# Altium project OCP-TimeCardMini-TI.PrjPcb (part 3 of 6)

## Sheet 11-DPLL-2.SchDoc
size B; SheetNumber: 11; SheetTotal: 25; SPICEModelCacheYEUHMWUF: <root> / <DocumentId>YEUHMWUF</DocumentId> / </root>
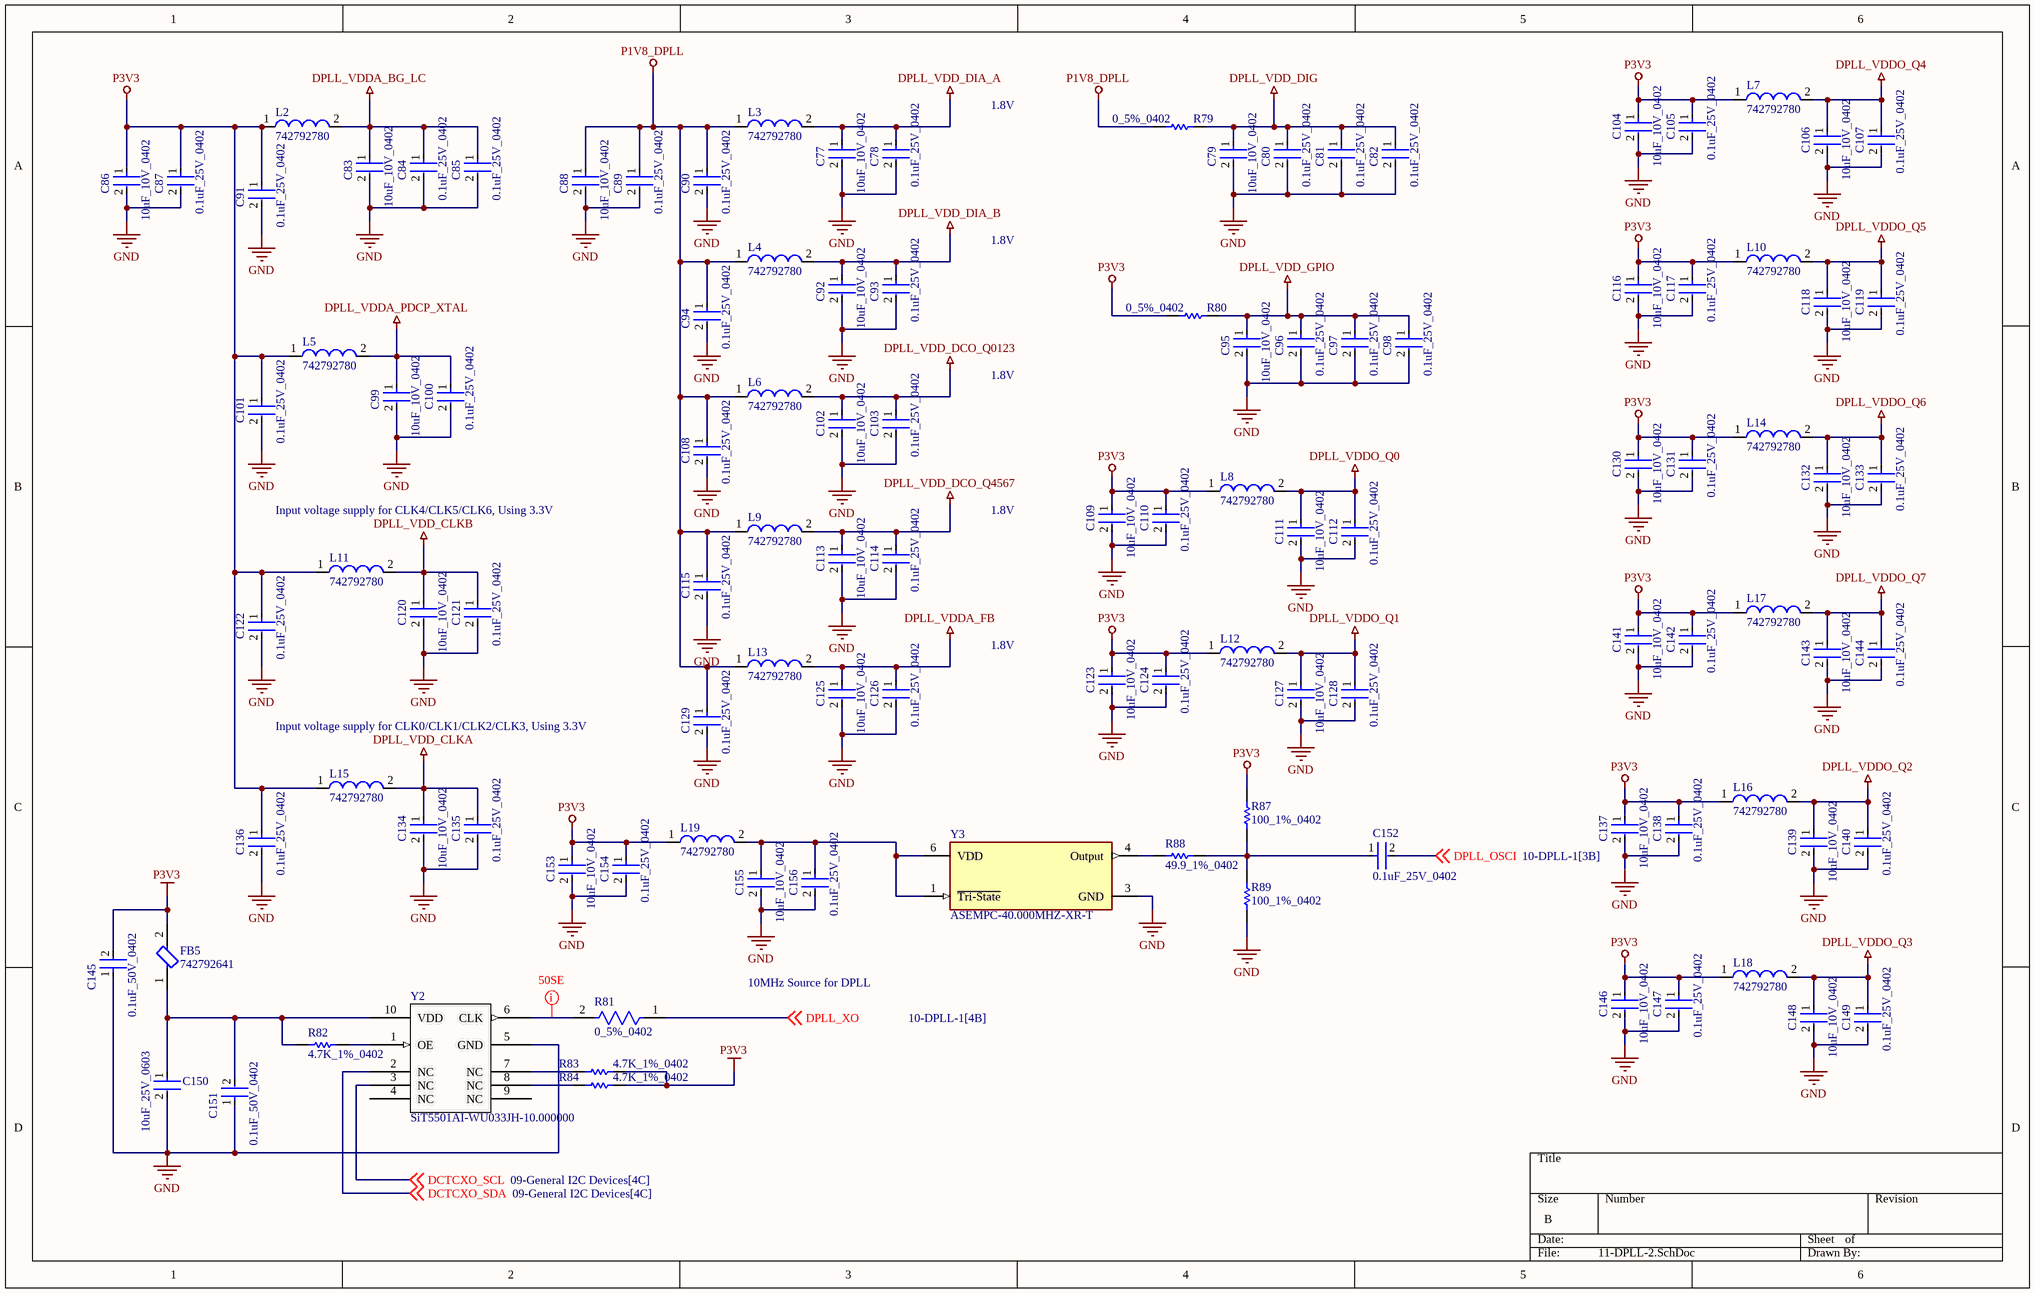
[diagram p10: 11-DPLL-2.SchDoc]

### Parts
C77  10uF_10V_0402  [FP-CL05A106MP5NUNC-MFG]
C78  0.1uF_25V_0402  [FP-0402-L_1_0_1-W_0_5_0_1-IPC_C]
C79  10uF_10V_0402  [FP-CL05A106MP5NUNC-MFG]
C80  0.1uF_25V_0402  [FP-0402-L_1_0_1-W_0_5_0_1-IPC_C]
C81  0.1uF_25V_0402  [FP-0402-L_1_0_1-W_0_5_0_1-IPC_C]
C82  0.1uF_25V_0402  [FP-0402-L_1_0_1-W_0_5_0_1-IPC_C]
C83  10uF_10V_0402  [FP-CL05A106MP5NUNC-MFG]
C84  0.1uF_25V_0402  [FP-0402-L_1_0_1-W_0_5_0_1-IPC_C]
C85  0.1uF_25V_0402  [FP-0402-L_1_0_1-W_0_5_0_1-IPC_C]
C86  10uF_10V_0402  [FP-CL05A106MP5NUNC-MFG]
C87  0.1uF_25V_0402  [FP-0402-L_1_0_1-W_0_5_0_1-IPC_C]
C88  10uF_10V_0402  [FP-CL05A106MP5NUNC-MFG]
C89  0.1uF_25V_0402  [FP-0402-L_1_0_1-W_0_5_0_1-IPC_C]
C90  0.1uF_25V_0402  [FP-0402-L_1_0_1-W_0_5_0_1-IPC_C]
C91  0.1uF_25V_0402  [FP-0402-L_1_0_1-W_0_5_0_1-IPC_C]
C92  10uF_10V_0402  [FP-CL05A106MP5NUNC-MFG]
C93  0.1uF_25V_0402  [FP-0402-L_1_0_1-W_0_5_0_1-IPC_C]
C94  0.1uF_25V_0402  [FP-0402-L_1_0_1-W_0_5_0_1-IPC_C]
C95  10uF_10V_0402  [FP-CL05A106MP5NUNC-MFG]
C96  0.1uF_25V_0402  [FP-0402-L_1_0_1-W_0_5_0_1-IPC_C]
C97  0.1uF_25V_0402  [FP-0402-L_1_0_1-W_0_5_0_1-IPC_C]
C98  0.1uF_25V_0402  [FP-0402-L_1_0_1-W_0_5_0_1-IPC_C]
C99  10uF_10V_0402  [FP-CL05A106MP5NUNC-MFG]
C100  0.1uF_25V_0402  [FP-0402-L_1_0_1-W_0_5_0_1-IPC_C]
C101  0.1uF_25V_0402  [FP-0402-L_1_0_1-W_0_5_0_1-IPC_C]
C102  10uF_10V_0402  [FP-CL05A106MP5NUNC-MFG]
C103  0.1uF_25V_0402  [FP-0402-L_1_0_1-W_0_5_0_1-IPC_C]
C104  10uF_10V_0402  [FP-CL05A106MP5NUNC-MFG]
C105  0.1uF_25V_0402  [FP-0402-L_1_0_1-W_0_5_0_1-IPC_C]
C106  10uF_10V_0402  [FP-CL05A106MP5NUNC-MFG]
C107  0.1uF_25V_0402  [FP-0402-L_1_0_1-W_0_5_0_1-IPC_C]
C108  0.1uF_25V_0402  [FP-0402-L_1_0_1-W_0_5_0_1-IPC_C]
C109  10uF_10V_0402  [FP-CL05A106MP5NUNC-MFG]
C110  0.1uF_25V_0402  [FP-0402-L_1_0_1-W_0_5_0_1-IPC_C]
C111  10uF_10V_0402  [FP-CL05A106MP5NUNC-MFG]
C112  0.1uF_25V_0402  [FP-0402-L_1_0_1-W_0_5_0_1-IPC_C]
C113  10uF_10V_0402  [FP-CL05A106MP5NUNC-MFG]
C114  0.1uF_25V_0402  [FP-0402-L_1_0_1-W_0_5_0_1-IPC_C]
C115  0.1uF_25V_0402  [FP-0402-L_1_0_1-W_0_5_0_1-IPC_C]
C116  10uF_10V_0402  [FP-CL05A106MP5NUNC-MFG]
C117  0.1uF_25V_0402  [FP-0402-L_1_0_1-W_0_5_0_1-IPC_C]
C118  10uF_10V_0402  [FP-CL05A106MP5NUNC-MFG]
C119  0.1uF_25V_0402  [FP-0402-L_1_0_1-W_0_5_0_1-IPC_C]
C120  10uF_10V_0402  [FP-CL05A106MP5NUNC-MFG]
C121  0.1uF_25V_0402  [FP-0402-L_1_0_1-W_0_5_0_1-IPC_C]
C122  0.1uF_25V_0402  [FP-0402-L_1_0_1-W_0_5_0_1-IPC_C]
C123  10uF_10V_0402  [FP-CL05A106MP5NUNC-MFG]
C124  0.1uF_25V_0402  [FP-0402-L_1_0_1-W_0_5_0_1-IPC_C]
C125  10uF_10V_0402  [FP-CL05A106MP5NUNC-MFG]
C126  0.1uF_25V_0402  [FP-0402-L_1_0_1-W_0_5_0_1-IPC_C]
C127  10uF_10V_0402  [FP-CL05A106MP5NUNC-MFG]
C128  0.1uF_25V_0402  [FP-0402-L_1_0_1-W_0_5_0_1-IPC_C]
C129  0.1uF_25V_0402  [FP-0402-L_1_0_1-W_0_5_0_1-IPC_C]
C130  10uF_10V_0402  [FP-CL05A106MP5NUNC-MFG]
C131  0.1uF_25V_0402  [FP-0402-L_1_0_1-W_0_5_0_1-IPC_C]
C132  10uF_10V_0402  [FP-CL05A106MP5NUNC-MFG]
C133  0.1uF_25V_0402  [FP-0402-L_1_0_1-W_0_5_0_1-IPC_C]
C134  10uF_10V_0402  [FP-CL05A106MP5NUNC-MFG]
C135  0.1uF_25V_0402  [FP-0402-L_1_0_1-W_0_5_0_1-IPC_C]
C136  0.1uF_25V_0402  [FP-0402-L_1_0_1-W_0_5_0_1-IPC_C]
C137  10uF_10V_0402  [FP-CL05A106MP5NUNC-MFG]
C138  0.1uF_25V_0402  [FP-0402-L_1_0_1-W_0_5_0_1-IPC_C]
C139  10uF_10V_0402  [FP-CL05A106MP5NUNC-MFG]
C140  0.1uF_25V_0402  [FP-0402-L_1_0_1-W_0_5_0_1-IPC_C]
C141  10uF_10V_0402  [FP-CL05A106MP5NUNC-MFG]
C142  0.1uF_25V_0402  [FP-0402-L_1_0_1-W_0_5_0_1-IPC_C]
C143  10uF_10V_0402  [FP-CL05A106MP5NUNC-MFG]
C144  0.1uF_25V_0402  [FP-0402-L_1_0_1-W_0_5_0_1-IPC_C]
C145  0.1uF_50V_0402  [FP-C1005-050-0_05-IPC_C]
C146  10uF_10V_0402  [FP-CL05A106MP5NUNC-MFG]
C147  0.1uF_25V_0402  [FP-0402-L_1_0_1-W_0_5_0_1-IPC_C]
C148  10uF_10V_0402  [FP-CL05A106MP5NUNC-MFG]
C149  0.1uF_25V_0402  [FP-0402-L_1_0_1-W_0_5_0_1-IPC_C]
C150  10uF_25V_0603  [FP-CL10-IPC_C]
C151  0.1uF_50V_0402  [FP-C1005-050-0_05-IPC_C]
C152  0.1uF_25V_0402  [FP-0402-L_1_0_1-W_0_5_0_1-IPC_C]
C153  10uF_10V_0402  [FP-CL05A106MP5NUNC-MFG]
C154  0.1uF_25V_0402  [FP-0402-L_1_0_1-W_0_5_0_1-IPC_C]
C155  10uF_10V_0402  [FP-CL05A106MP5NUNC-MFG]
C156  0.1uF_25V_0402  [FP-0402-L_1_0_1-W_0_5_0_1-IPC_C]
FB5  742792641  [FP-742792641-MFG]
L2  742792780  [SMD-0402]
L3  742792780  [SMD-0402]
L4  742792780  [SMD-0402]
L5  742792780  [SMD-0402]
L6  742792780  [SMD-0402]
L7  742792780  [SMD-0402]
L8  742792780  [SMD-0402]
L9  742792780  [SMD-0402]
L10  742792780  [SMD-0402]
L11  742792780  [SMD-0402]
L12  742792780  [SMD-0402]
L13  742792780  [SMD-0402]
L14  742792780  [SMD-0402]
L15  742792780  [SMD-0402]
L16  742792780  [SMD-0402]
L17  742792780  [SMD-0402]
L18  742792780  [SMD-0402]
L19  742792780  [SMD-0402]
R79  0_5%_0402  [RESC1005X40X25LL10T10]
R80  0_5%_0402  [RESC1005X40X25LL10T10]
R81  0_5%_0402  [FP-AC0402-0_37-IPC_B]
R82  4.7K_1%_0402  [RESC1005X40X25NL10T10]
R83  4.7K_1%_0402  [RESC1005X40X25NL10T10]
R84  4.7K_1%_0402  [RESC1005X40X25NL10T10]
R87  100_1%_0402  [RESC1005X40X25ML05T10]
R88  49.9_1%_0402  [RESC1005X40X25NL10T10]
R89  100_1%_0402  [RESC1005X40X25ML05T10]
Y2  Manufacturer Part Number: SiT5501AI-WU033JH-10.000000  [SITIME_SPL-086-CQFN-010-C07050_REV_DRAFT]  (hidden comment: SiTime_SiT5501AC-WU-33E0-10T)
Y3  ASEMPC-40.000MHZ-XR-T  [FP-ASEMP-CMOS-MFG]

### Nets
DPLL_VDD_CLKA: C134.1 C135.1 L15.2
DPLL_VDD_CLKB: C120.1 C121.1 L11.2
DPLL_VDD_DCO_Q0123: C102.1 C103.1 L6.2
DPLL_VDD_DCO_Q4567: C113.1 C114.1 L9.2
DPLL_VDD_DIA_A: C77.1 C78.1 L3.2
DPLL_VDD_DIA_B: C92.1 C93.1 L4.2
DPLL_VDD_DIG: C79.1 C80.1 C81.1 C82.1 R79.2
DPLL_VDD_GPIO: C95.1 C96.1 C97.1 C98.1 R80.2
DPLL_VDDA_BG_LC: C83.1 C84.1 C85.1 L2.2
DPLL_VDDA_FB: C125.1 C126.1 L13.2
DPLL_VDDA_PDCP_XTAL: C99.1 C100.1 L5.2
DPLL_VDDO_Q0: C111.1 C112.1 L8.2
DPLL_VDDO_Q1: C127.1 C128.1 L12.2
DPLL_VDDO_Q2: C139.1 C140.1 L16.2
DPLL_VDDO_Q3: C148.1 C149.1 L18.2
DPLL_VDDO_Q4: C106.1 C107.1 L7.2
DPLL_VDDO_Q5: C118.1 C119.1 L10.2
DPLL_VDDO_Q6: C132.1 C133.1 L14.2
DPLL_VDDO_Q7: C143.1 C144.1 L17.2
GND: C77.2 C78.2 C79.2 C80.2 C81.2 C82.2 C83.2 C84.2 C85.2 C86.2 C87.2 C88.2 C89.2 C90.2 C91.2 C92.2 C93.2 C94.2 C95.2 C96.2 C97.2 C98.2 C99.2 C100.2 C101.2 C102.2 C103.2 C104.2 C105.2 C106.2 C107.2 C108.2 C109.2 C110.2 C111.2 C112.2 C113.2 C114.2 C115.2 C116.2 C117.2 C118.2 C119.2 C120.2 C121.2 C122.2 C123.2 C124.2 C125.2 C126.2 C127.2 C128.2 C129.2 C130.2 C131.2 C132.2 C133.2 C134.2 C135.2 C136.2 C137.2 C138.2 C139.2 C140.2 C141.2 C142.2 C143.2 C144.2 C145.1 C146.2 C147.2 C148.2 C149.2 C150.2 C151.1 C153.2 C154.2 C155.2 C156.2 R89.1 Y2.5(GND) Y3.3(GND)
P1V8_DPLL: C88.1 C89.1 C90.1 C94.1 C108.1 C115.1 C129.1 L3.1 L4.1 L6.1 L9.1 L13.1 R79.1
P3V3: C86.1 C87.1 C91.1 C101.1 C104.1 C105.1 C109.1 C110.1 C116.1 C117.1 C122.1 C123.1 C124.1 C130.1 C131.1 C136.1 C137.1 C138.1 C141.1 C142.1 C145.2 C146.1 C147.1 C153.1 C154.1 FB5.2 L2.1 L5.1 L7.1 L8.1 L10.1 L11.1 L12.1 L14.1 L15.1 L16.1 L17.1 L18.1 L19.1 R80.1 R83.2 R84.2 R87.2
DCTCXO_SCL: Y2.3(NC) ; off-sheet DCTCXO_SCL
DCTCXO_SDA: Y2.2(NC) ; off-sheet DCTCXO_SDA
DPLL_OSCI: C152.2 ; off-sheet DPLL_OSCI
DPLL_XO: R81.1 ; off-sheet DPLL_XO
NetC150_1: C150.1 C151.2 FB5.1 R82.1 Y2.10(VDD)
NetC152_1: C152.1 R87.1 R88.2 R89.2
NetC155_1: C155.1 C156.1 L19.2 Y3.1(~{Tri-State}) Y3.6(VDD)
NetR81_2: R81.2 Y2.6(CLK)
NetR82_2: R82.2 Y2.1(OE)
NetR83_1: R83.1 Y2.7(NC)
NetR84_1: R84.1 Y2.8(NC)
NetR88_1: R88.1 Y3.4(Output)

Not connected (* = marked no-connect by the designer): Y2 4(NC) 9(NC)

### Layout directives
net class 50SE: NetR81_2

### Notes on the sheet
- 1.8V
- Input voltage supply for CLK4/CLK5/CLK6, Using 3.3V
- Input voltage supply for CLK0/CLK1/CLK2/CLK3, Using 3.3V
- 10MHz Source for DPLL

### Library data of the parts
C77 C79 C83 C86 C88 C92 C95 C99 C102 C104 C106 C109 C111 C113 C116 C118 C120 C123 C125 C127 C130 C132 C134 C137 C139 C141 C143 C146 C148 C153 C155 = CMP-13271-000002-1: CAP CER 10UF 10V X5R 0402; Manufacturer Part Number: CL05A106MP5NUNC; Manufacturer: Samsung; Temperature Coefficient: 15%; Tolerance: 20%; Material: Ceramic; Octopart: https://octopart.com/cl05a106mp5nunc-samsung-22457395; Voltage Rating: 10V; RoHS: TRUE; Value: 10uF; Height: 0.7mm; Digikey Description: CAP CER 10UF 10V X5R 0402; Automotive: No; Package: CL05A106MP5NUNC; Device Class L1: Passive Components; Capacitance: 10uF; Temperature Range High: +85°C; ComponentLink2Description: Datasheet; Device Class L2: Capacitors; Temperature Characteristic: X5R; Temperature: -55°C to +85°C; ComponentLink2URL: http://www.samsungsem.com/kr/support/product-search/mlcc/__icsFiles/afieldfile/2019/05/10/19-CL05A106MP5NUNC.pdf; Device Class L3: Ceramic Capacitors; Category: Cap; Temperature Range Low: -55°C; Ipc Land Pattern Name: CAPC10050X50; Lead Free: Yes
C78 C80-C82 C84 C85 C87 C89-C91 C93 C94 C96-C98 C100 C101 C103 C105 C107 C108 C110 C112 C114 C115 C117 C119 C121 C122 C124 C126 C128 C129 C131 C133 C135 C136 C138 C140 C142 C144 C147 C149 C152 C154 C156 = CMP-2008-02519-2: General Purpose Ceramic Capacitor, 0402, 100nF, 10%, X7R, 15%, 25V; Package Quantity: 1; Capacitance: 100nF; Min Operating Temperature: -55°C; Voltage: 25V; Voltage Rating: 25V; Construction: Flat; Max Operating Temperature: 125°C; Radiation Hardening: No; Depth: 0.5mm; Thickness: 0.022inch; Voltage Rating (DC): 25V; Number of Pins: 2; Lead Free: Lead Free; Series: -; REACH SVHC: No SVHC; Length: 1mm; Dielectric: X7R; RoHS Compliant: Yes; Mount: Surface Mount; Packaging: Tape and Reel; Case/Package: 0402; Case Code (Imperial): 0402; Termination: SMD/SMT; Width: 0.02inch; Case Code (Metric): 1005; Tolerance: 10%
C145 C151 = CMP-2000-05393-2: Multilayer Ceramic Capacitors 100nF ±10% 50V X7R SMD 0402; Voltage: 50V; Dielectric Material: Ceramic; Min Operating Temperature: -55°C; Depth: 0.5mm; Radiation Hardening: No; RoHS Compliant: Yes; Voltage Rating (DC): 50V; Lead Free: Lead Free; Resistor Type: Ceramic; Height: 0.5mm; Dielectric: X7R; Thickness: 0.022inch; Case/Package: 0402; Case Code (Metric): 1005; Termination: SMD/SMT; Capacitance: 100nF; Packaging: Tape and Reel; Max Operating Temperature: 125°C; Mount: Surface Mount; Package Quantity: 1; Width: 0.02inch; Weight: 2.3E-05oz; Voltage Rating: 50V; Tolerance: 10%; Construction: Flat; Case Code (Imperial): 0402; Length: 1mm; REACH SVHC: No SVHC; Series: C
C150 = CMP-13271-004224-1: Cap Ceramic 10uF 25V X5R ±20% Pad SMD 0603 +85°C T/R; Width: 0.031inch; Voltage Rating: 25V; Length: 0.063inch; Case Code (Metric): 1608; Dielectric: X5R; Termination: Wraparound; Capacitance: 10uF; Lead Free: Lead Free; Mount: Surface Mount; Package Quantity: 1; Case Code (Imperial): 0603; Thickness: 0.035inch; Packaging: Tape and Reel; Contact Plating: Tin; Min Operating Temperature: -55°C; Tolerance: 20%; Max Operating Temperature: 85°C; Case/Package: 0603
FB5 = CMP-0220-00171-2: FERRITE BEAD 300 OHM 0603 1LN; Inductance: 18nH; Max DC Current: 2A; Number of Lines: 1; Test Frequency: 100MHz; Impedance: 300R; DC Resistance (DCR): 150mR; Tolerance: 25%; Case Code (Metric): 1608; Core Material: Ferrite; Length: 1.6mm; Lead Free: Lead Free; Series: WE-CBF; Min Operating Temperature: -55°C; RoHS Compliant: Yes; Case/Package: SMD/SMT; Material: Ferrite; Max Operating Temperature: 125°C; Termination: SMD/SMT; Packaging: Tape and Reel; Weight: 0.000141oz; Case Code (Imperial): 0603; Width: 0.8mm; Mount: Surface Mount; Max Current Rating: 2A; Package Quantity: 1; Depth: 0.8mm; Current Rating: 2A; Height: 0.8mm
L2-L19 = CMP-0220-00137-1: SMD EMI Suppression Ferrite Bead WE-CBF, Z = 220 Ohm; Impedance: 220 Ohm; PackageVersion: 2009; DatasheetVersion: ver 4, Jul-2009; PackageDescription: Chip Inductor, 2-Leads, Body 1.0 x 0.5 mm; ComponentLink1URL: http://www.we-online.com; ComponentLink1Description: Manufacturer Link; ComponentLink2URL: http://www.we-online.de/katalog/media/pdf/742792780.pdf; PackageReference: SMD-0402; ComponentLink2Description: Datasheet
R79 R80 = CMP-2002-04569-1: Manufacturer: KOA Speer; Part Number: RK73Z1ETTP
R81 = CMP-2002-01772-2: RESISTOR 0402 JUMPER ZERO OHM; Voltage Rating: 50V; Temperature Coefficient: 200ppm/°C; Tolerance: 1%; Power Rating: 62.5mW; Resistance: 0R; Min Operating Temperature: -55°C; Termination: SMD/SMT; Case/Package: 0402; Case Code (Imperial): 0402; Packaging: Tape and Reel; Case Code (Metric): 1005; Max Operating Temperature: 155°C; Series: AC
R82-R84 = CMP-2002-05217-1: as R117-R120 on sheet 09-General I2C Devices
R87 R89 = CMP-2002-06458-1: Part Number: ERJ-U02F1000X; Manufacturer: Panasonic
R88 = CMP-2002-04448-1: Part Number: RK73H1ETTP49R9F; Manufacturer: KOA Speer
Y2 = CMP-OSC-00029-2: OSC, MEMS, STRATUM 3E, 10.000MHZ, 10PPB STAB, LVCMOS, 3.3V, O/P EN, 7.0X5.0X2.2MM, CQFN-10; Manufacturer: SiTime; Frequency: 10 MHz; Voltage - Supply: 3.3 V; Type: OCXO; Category: Oscillators; Max Operating Temperature: 70°C; Min Operating Temperature: -20°C; Height: 2.20mm (max); Case/Package: 10 Lead QFN; Output: LVCMOS; Mounting Type: Surface Mount; Frequency Stability: ±10 ppb; RoHS: Yes
Y3 = CMP-27762-012912-1: MEMS Oscillator 40MHz ±25ppm CMOS 2.25V~3.6V 6-SMD 3.2mm x 2.5mm; Max Supply Current: 35mA; Max Duty Cycle: 55%; Operating Supply Voltage: 3.3V; Max Supply Voltage: 3.6V; Load Capacitance: 15pF; Min Supply Voltage: 2.25V; Termination: SMD/SMT; Frequency: 40MHz; Length: 0.126inch; Case/Package: SMD/SMT; Max Operating Temperature: 105°C; RoHS Compliant: Yes; Mount: Surface Mount; Packaging: Tape and Reel; Number of Pins: 6; Width: 0.098inch; Min Operating Temperature: -40°C; Frequency Stability: 25ppm; Height: 0.035inch; Package Quantity: 1000

## Sheet 12-AM64x-01.SchDoc
size B; SheetNumber: 12; SheetTotal: 25
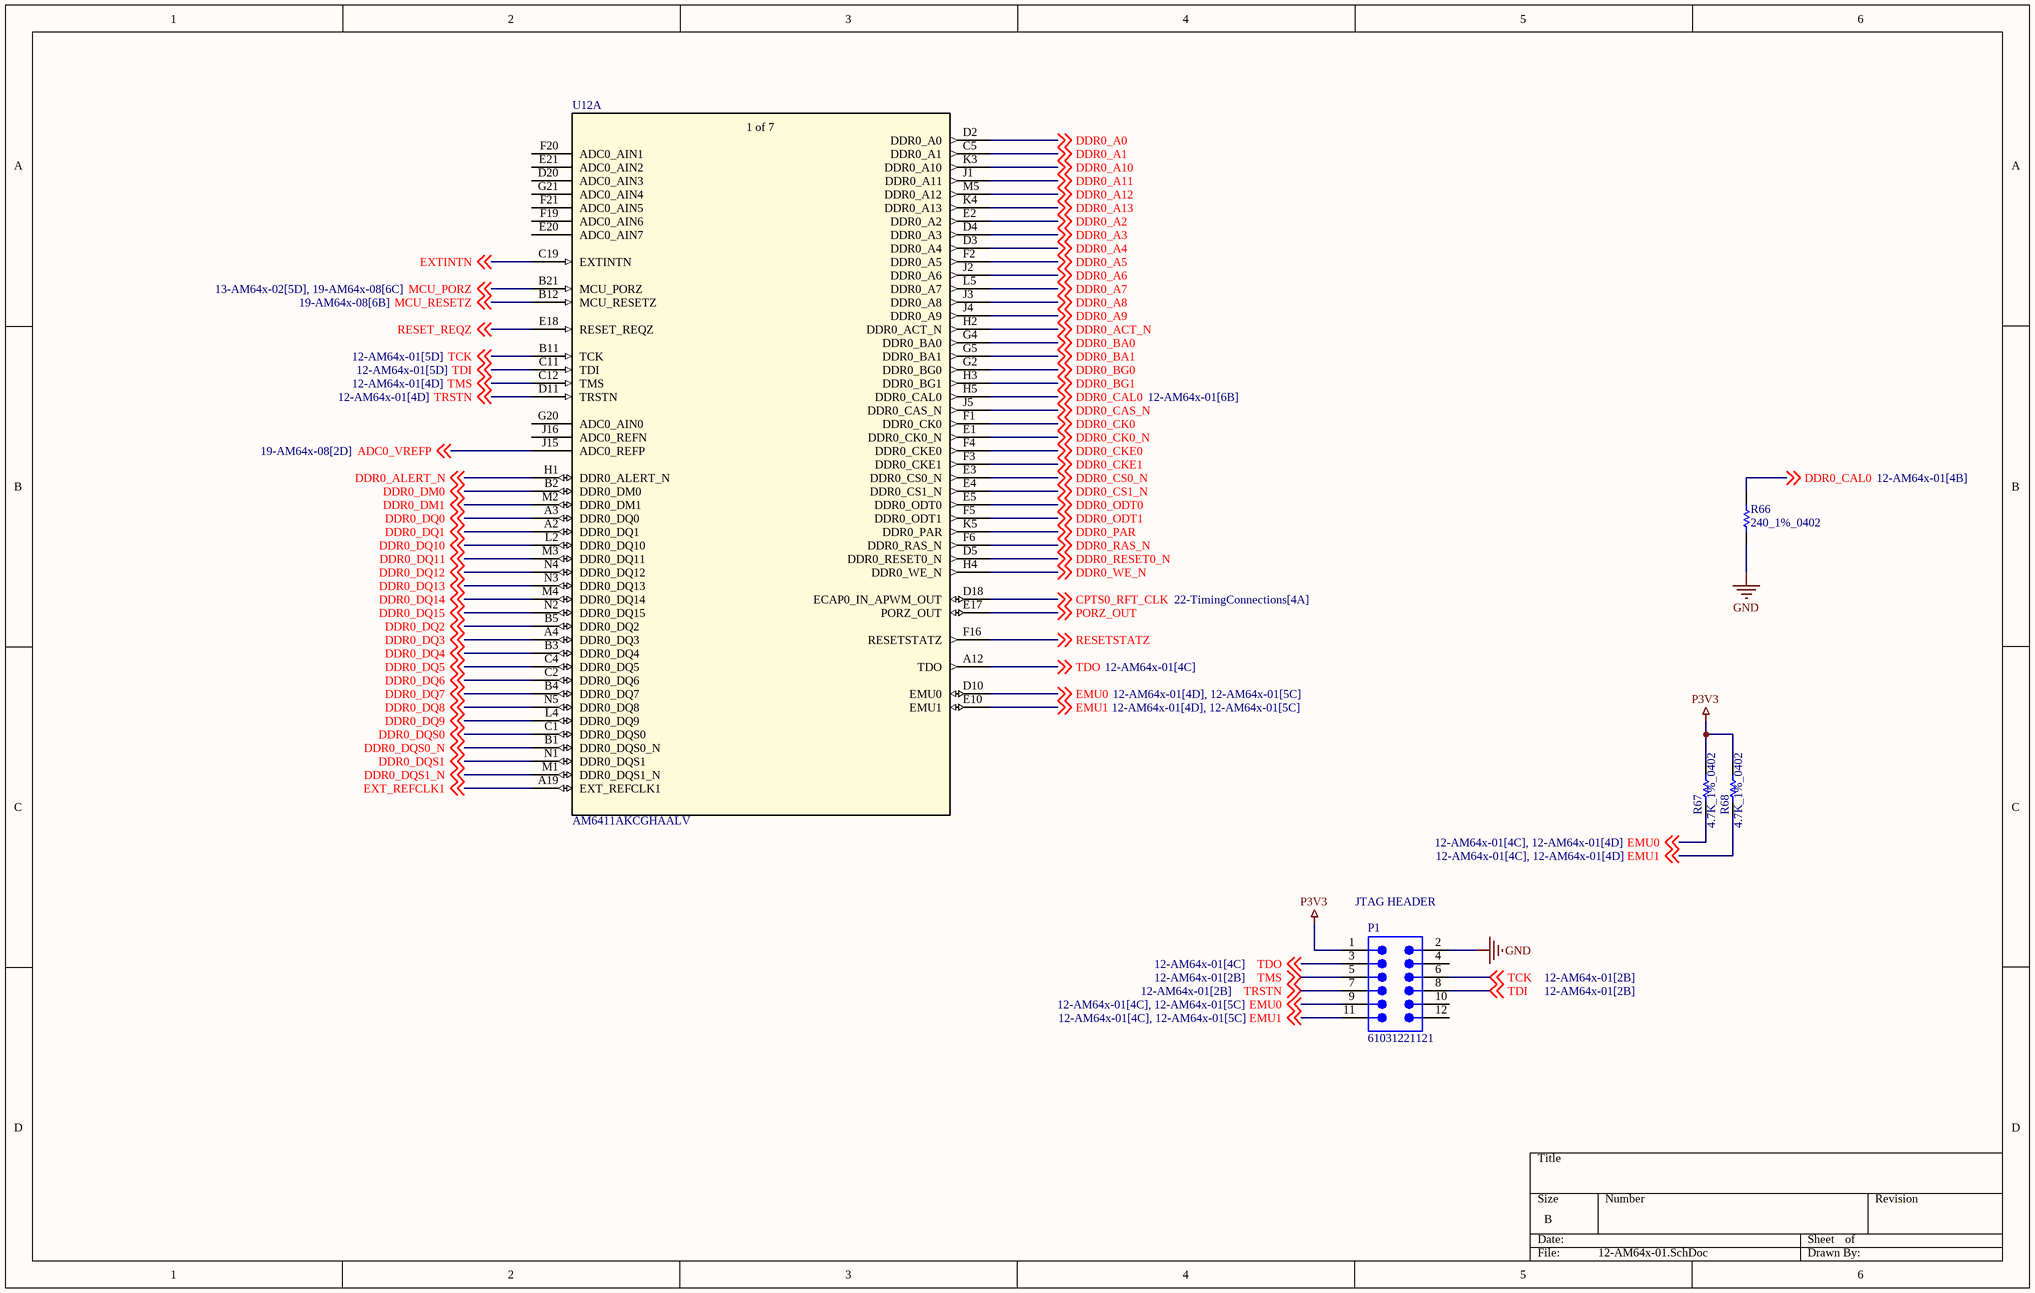
[diagram p11: 12-AM64x-01.SchDoc]

### Parts
P1  61031221121  [61031221121]
R66  240_1%_0402  [RESC1005X40X25ML05T05]
R67  4.7K_1%_0402  [RESC1005X40X25NL10T10]
R68  4.7K_1%_0402  [RESC1005X40X25NL10T10]
U12  AM6411AKCGHAALV  [FCBGA441_ALV_TEX]  (part A of 7)

### Nets
GND: P1.2 R66.1
P3V3: P1.1 R67.1 R68.1
ADC0_VREFP: U12.J15(ADC0_REFP) ; off-sheet ADC0_VREFP
CPTS0_RFT_CLK: U12.D18(ECAP0_IN_APWM_OUT) ; off-sheet CPTS0_RFT_CLK
DDR0_A0: U12.D2(DDR0_A0) ; off-sheet DDR0_A0
DDR0_A1: U12.C5(DDR0_A1) ; off-sheet DDR0_A1
DDR0_A2: U12.E2(DDR0_A2) ; off-sheet DDR0_A2
DDR0_A3: U12.D4(DDR0_A3) ; off-sheet DDR0_A3
DDR0_A4: U12.D3(DDR0_A4) ; off-sheet DDR0_A4
DDR0_A5: U12.F2(DDR0_A5) ; off-sheet DDR0_A5
DDR0_A6: U12.J2(DDR0_A6) ; off-sheet DDR0_A6
DDR0_A7: U12.L5(DDR0_A7) ; off-sheet DDR0_A7
DDR0_A8: U12.J3(DDR0_A8) ; off-sheet DDR0_A8
DDR0_A9: U12.J4(DDR0_A9) ; off-sheet DDR0_A9
DDR0_A10: U12.K3(DDR0_A10) ; off-sheet DDR0_A10
DDR0_A11: U12.J1(DDR0_A11) ; off-sheet DDR0_A11
DDR0_A12: U12.M5(DDR0_A12) ; off-sheet DDR0_A12
DDR0_A13: U12.K4(DDR0_A13) ; off-sheet DDR0_A13
DDR0_ACT_N: U12.H2(DDR0_ACT_N) ; off-sheet DDR0_ACT_N
DDR0_ALERT_N: U12.H1(DDR0_ALERT_N) ; off-sheet DDR0_ALERT_N
DDR0_BA0: U12.G4(DDR0_BA0) ; off-sheet DDR0_BA0
DDR0_BA1: U12.G5(DDR0_BA1) ; off-sheet DDR0_BA1
DDR0_BG0: U12.G2(DDR0_BG0) ; off-sheet DDR0_BG0
DDR0_BG1: U12.H3(DDR0_BG1) ; off-sheet DDR0_BG1
DDR0_CAL0: R66.2 U12.H5(DDR0_CAL0) ; off-sheet DDR0_CAL0
DDR0_CAS_N: U12.J5(DDR0_CAS_N) ; off-sheet DDR0_CAS_N
DDR0_CK0: U12.F1(DDR0_CK0) ; off-sheet DDR0_CK0
DDR0_CK0_N: U12.E1(DDR0_CK0_N) ; off-sheet DDR0_CK0_N
DDR0_CKE0: U12.F4(DDR0_CKE0) ; off-sheet DDR0_CKE0
DDR0_CKE1: U12.F3(DDR0_CKE1) ; off-sheet DDR0_CKE1
DDR0_CS0_N: U12.E3(DDR0_CS0_N) ; off-sheet DDR0_CS0_N
DDR0_CS1_N: U12.E4(DDR0_CS1_N) ; off-sheet DDR0_CS1_N
DDR0_DM0: U12.B2(DDR0_DM0) ; off-sheet DDR0_DM0
DDR0_DM1: U12.M2(DDR0_DM1) ; off-sheet DDR0_DM1
DDR0_DQ0: U12.A3(DDR0_DQ0) ; off-sheet DDR0_DQ0
DDR0_DQ1: U12.A2(DDR0_DQ1) ; off-sheet DDR0_DQ1
DDR0_DQ2: U12.B5(DDR0_DQ2) ; off-sheet DDR0_DQ2
DDR0_DQ3: U12.A4(DDR0_DQ3) ; off-sheet DDR0_DQ3
DDR0_DQ4: U12.B3(DDR0_DQ4) ; off-sheet DDR0_DQ4
DDR0_DQ5: U12.C4(DDR0_DQ5) ; off-sheet DDR0_DQ5
DDR0_DQ6: U12.C2(DDR0_DQ6) ; off-sheet DDR0_DQ6
DDR0_DQ7: U12.B4(DDR0_DQ7) ; off-sheet DDR0_DQ7
DDR0_DQ8: U12.N5(DDR0_DQ8) ; off-sheet DDR0_DQ8
DDR0_DQ9: U12.L4(DDR0_DQ9) ; off-sheet DDR0_DQ9
DDR0_DQ10: U12.L2(DDR0_DQ10) ; off-sheet DDR0_DQ10
DDR0_DQ11: U12.M3(DDR0_DQ11) ; off-sheet DDR0_DQ11
DDR0_DQ12: U12.N4(DDR0_DQ12) ; off-sheet DDR0_DQ12
DDR0_DQ13: U12.N3(DDR0_DQ13) ; off-sheet DDR0_DQ13
DDR0_DQ14: U12.M4(DDR0_DQ14) ; off-sheet DDR0_DQ14
DDR0_DQ15: U12.N2(DDR0_DQ15) ; off-sheet DDR0_DQ15
DDR0_DQS0: U12.C1(DDR0_DQS0) ; off-sheet DDR0_DQS0
DDR0_DQS0_N: U12.B1(DDR0_DQS0_N) ; off-sheet DDR0_DQS0_N
DDR0_DQS1: U12.N1(DDR0_DQS1) ; off-sheet DDR0_DQS1
DDR0_DQS1_N: U12.M1(DDR0_DQS1_N) ; off-sheet DDR0_DQS1_N
DDR0_ODT0: U12.E5(DDR0_ODT0) ; off-sheet DDR0_ODT0
DDR0_ODT1: U12.F5(DDR0_ODT1) ; off-sheet DDR0_ODT1
DDR0_PAR: U12.K5(DDR0_PAR) ; off-sheet DDR0_PAR
DDR0_RAS_N: U12.F6(DDR0_RAS_N) ; off-sheet DDR0_RAS_N
DDR0_RESET0_N: U12.D5(DDR0_RESET0_N) ; off-sheet DDR0_RESET0_N
DDR0_WE_N: U12.H4(DDR0_WE_N) ; off-sheet DDR0_WE_N
EMU0: P1.9 R67.2 U12.D10(EMU0) ; off-sheet EMU0
EMU1: P1.11 R68.2 U12.E10(EMU1) ; off-sheet EMU1
EXT_REFCLK1: U12.A19(EXT_REFCLK1) ; off-sheet EXT_REFCLK1
EXTINTN: U12.C19(EXTINTN) ; off-sheet EXTINTN
MCU_PORZ: U12.B21(MCU_PORZ) ; off-sheet MCU_PORZ
MCU_RESETZ: U12.B12(MCU_RESETZ) ; off-sheet MCU_RESETZ
PORZ_OUT: U12.E17(PORZ_OUT) ; off-sheet PORZ_OUT
RESET_REQZ: U12.E18(RESET_REQZ) ; off-sheet RESET_REQZ
RESETSTATZ: U12.F16(RESETSTATZ) ; off-sheet RESETSTATZ
TCK: P1.6 U12.B11(TCK) ; off-sheet TCK
TDI: P1.8 U12.C11(TDI) ; off-sheet TDI
TDO: P1.3 U12.A12(TDO) ; off-sheet TDO
TMS: P1.5 U12.C12(TMS) ; off-sheet TMS
TRSTN: P1.7 U12.D11(TRSTN) ; off-sheet TRSTN

Not connected (* = marked no-connect by the designer): P1 4 10 12; U12 D20(ADC0_AIN3) E20(ADC0_AIN7) E21(ADC0_AIN2) F19(ADC0_AIN6) F20(ADC0_AIN1) F21(ADC0_AIN5) G20(ADC0_AIN0) G21(ADC0_AIN4) J16(ADC0_REFN)

### Notes on the sheet
- (near P1) JTAG HEADER
- (in symbol AM6411AKCGHAALV, part A) 1 of 7

### Library data of the parts
P1 = CMP-1502-01054-2: NexarPartId: 32855452; Number of Positions: 12; Current Rating: 3A; Pitch: 2.54mm; Gender: Male; Connector Type: Male Pin; Operating Supply Voltage: 250V; Contact Resistance: 20mΩ; Contact Plating: Gold; Number of Rows: 2; Lead Pitch: 2.54mm; Color: Black; Mount: Surface Mount; Packaging: Tape and Reel; Contact Mating Length: 5.9944mm; REACH SVHC: Unknown; Contact Material: Copper; Row Spacing: 2.54mm; Number of Pins: 12; Orientation: Vertical; Termination: Solder; RoHS: Compliant; Number of Contacts: 12
R66 = CMP-2002-08397-1: Manufacturer: Vishay Dale; Part Number: CRCW0402240RFKED
R67 R68 = CMP-2002-05217-1: as R117-R120 on sheet 09-General I2C Devices
U12 = AM6411AKCGHAALV: No Description Available; Mfr_Name: Texas Instruments; RefDes: RefDes; Type: Type

## Sheet 13-AM64x-02.SchDoc
size B; SheetNumber: 13; SheetTotal: 25
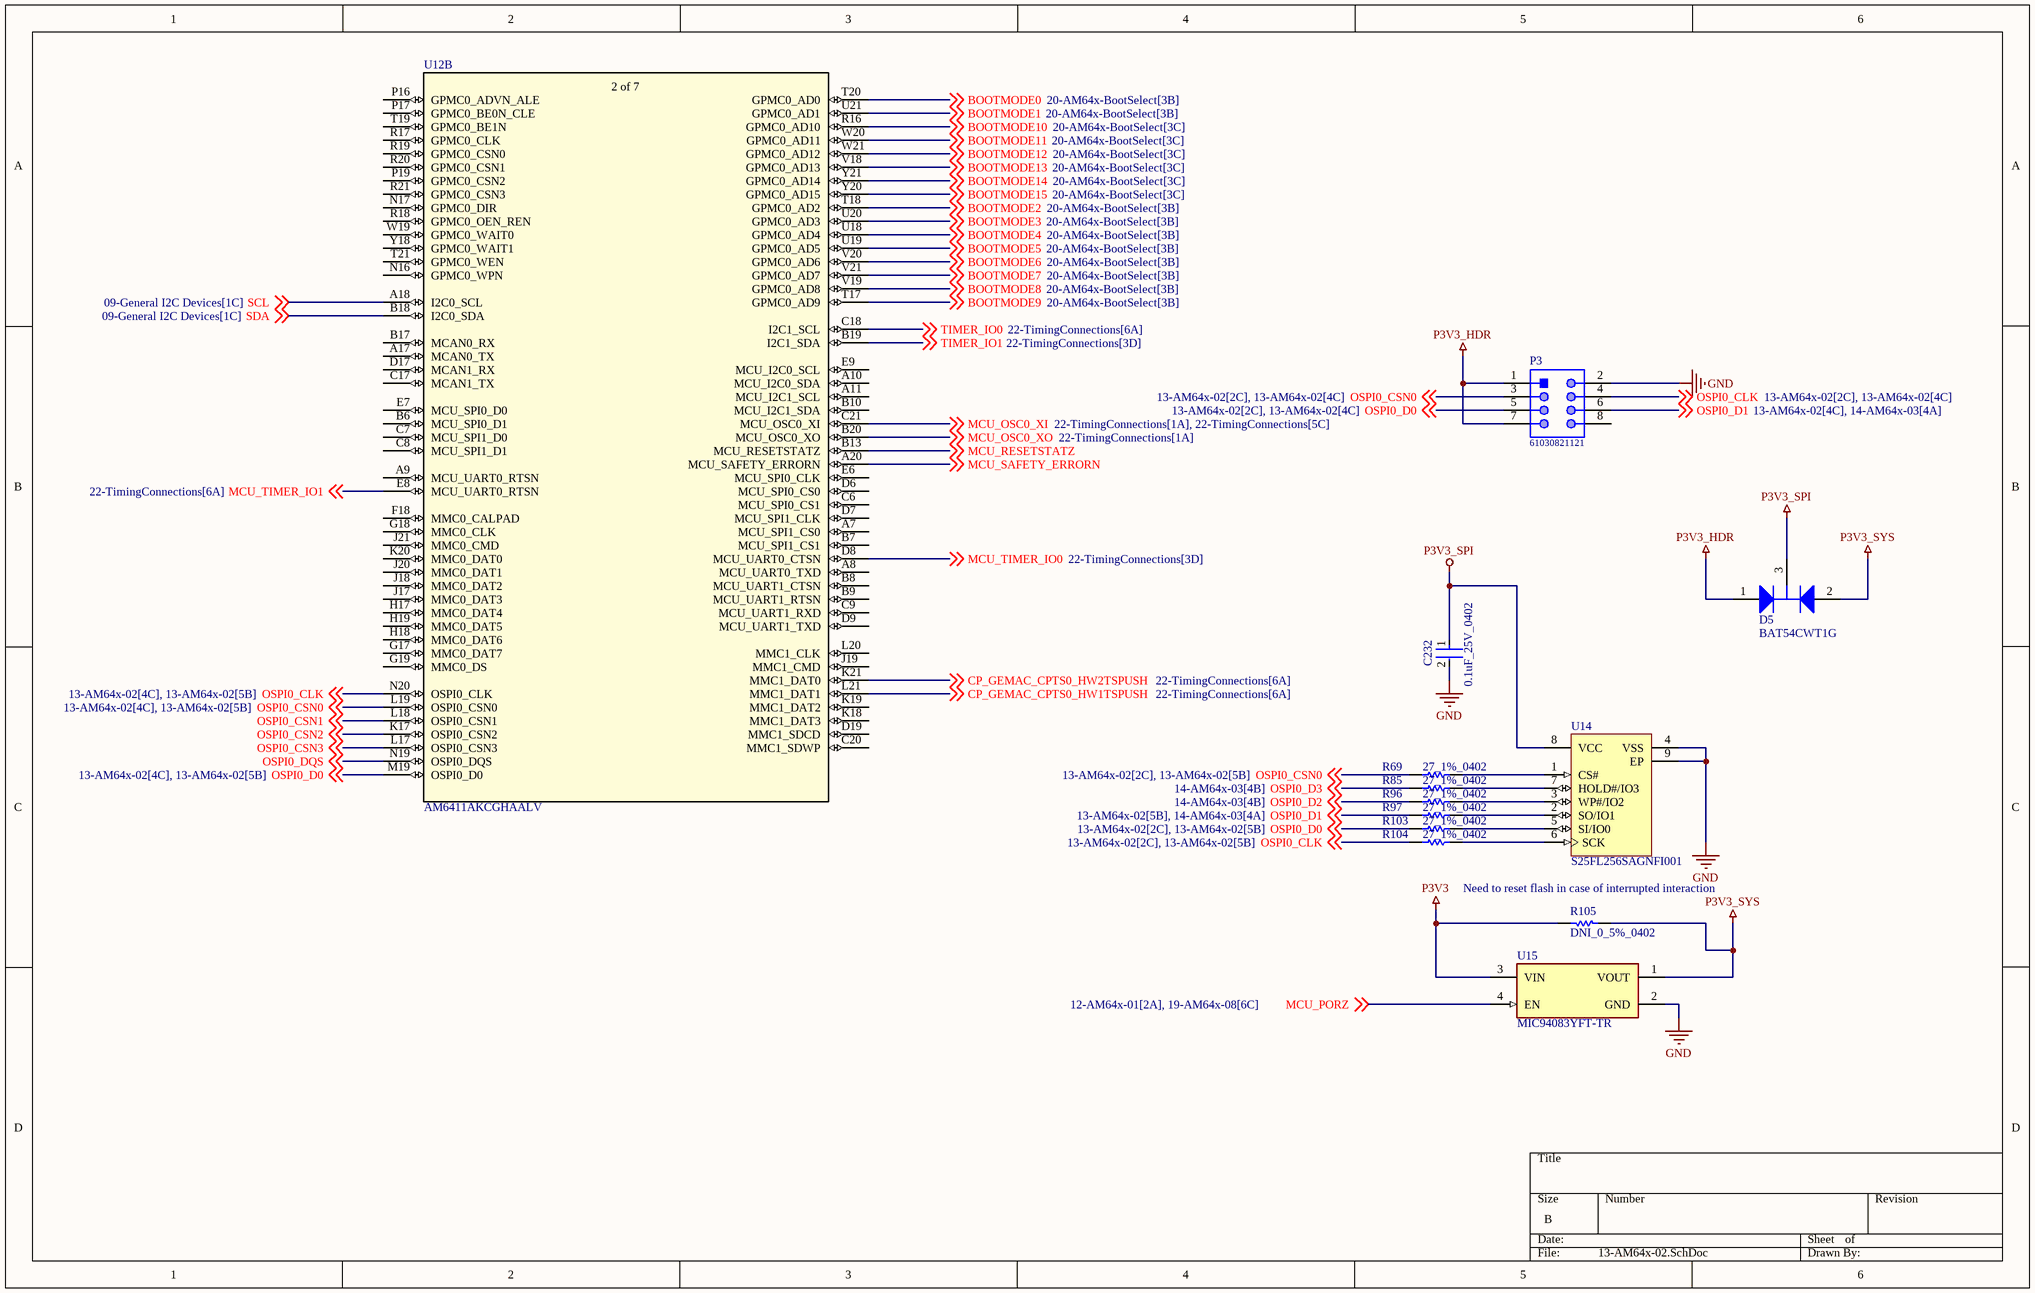
[diagram p12: 13-AM64x-02.SchDoc]

### Parts
C232  0.1uF_25V_0402  [FP-0402-L_1_0_1-W_0_5_0_1-IPC_C]
D5  BAT54CWT1G  [ONSC-SOT-323-3-419-04_V]
P3  61030821121  [61030821121]
R69  27_1%_0402  [RESC1005X40X25NL05T05]
R85  27_1%_0402  [RESC1005X40X25NL05T05]
R96  27_1%_0402  [RESC1005X40X25NL05T05]
R97  27_1%_0402  [RESC1005X40X25NL05T05]
R103  27_1%_0402  [RESC1005X40X25NL05T05]
R104  27_1%_0402  [RESC1005X40X25NL05T05]
R105  DNI_0_5%_0402  [RESC1005X40X25LL10T10]  (no BOM)
U12  AM6411AKCGHAALV  [FCBGA441_ALV_TEX]  (part B of 7)
U14  S25FL256SAGNFI001  [CYP-WSON-8_L]
U15  MIC94083YFT-TR  [FP-FTDFN085085-4LD-PL-1-MFG]

### Nets
GND: C232.2 P3.2 U14.4(VSS) U14.9(EP) U15.2(GND)
P3V3: R105.1 U15.3(VIN)
P3V3_HDR: D5.1(A1) P3.1 P3.7
P3V3_SPI: C232.1 D5.3(K) U14.8(VCC)
P3V3_SYS: D5.2(A2) R105.2 U15.1(VOUT)
BOOTMODE0: U12.T20(GPMC0_AD0) ; off-sheet BOOTMODE0
BOOTMODE1: U12.U21(GPMC0_AD1) ; off-sheet BOOTMODE1
BOOTMODE2: U12.T18(GPMC0_AD2) ; off-sheet BOOTMODE2
BOOTMODE3: U12.U20(GPMC0_AD3) ; off-sheet BOOTMODE3
BOOTMODE4: U12.U18(GPMC0_AD4) ; off-sheet BOOTMODE4
BOOTMODE5: U12.U19(GPMC0_AD5) ; off-sheet BOOTMODE5
BOOTMODE6: U12.V20(GPMC0_AD6) ; off-sheet BOOTMODE6
BOOTMODE7: U12.V21(GPMC0_AD7) ; off-sheet BOOTMODE7
BOOTMODE8: U12.V19(GPMC0_AD8) ; off-sheet BOOTMODE8
BOOTMODE9: U12.T17(GPMC0_AD9) ; off-sheet BOOTMODE9
BOOTMODE10: U12.R16(GPMC0_AD10) ; off-sheet BOOTMODE10
BOOTMODE11: U12.W20(GPMC0_AD11) ; off-sheet BOOTMODE11
BOOTMODE12: U12.W21(GPMC0_AD12) ; off-sheet BOOTMODE12
BOOTMODE13: U12.V18(GPMC0_AD13) ; off-sheet BOOTMODE13
BOOTMODE14: U12.Y21(GPMC0_AD14) ; off-sheet BOOTMODE14
BOOTMODE15: U12.Y20(GPMC0_AD15) ; off-sheet BOOTMODE15
CP_GEMAC_CPTS0_HW1TSPUSH: U12.L21(MMC1_DAT1) ; off-sheet CP_GEMAC_CPTS0_HW1TSPUSH
CP_GEMAC_CPTS0_HW2TSPUSH: U12.K21(MMC1_DAT0) ; off-sheet CP_GEMAC_CPTS0_HW2TSPUSH
MCU_OSC0_XI: U12.C21(MCU_OSC0_XI) ; off-sheet MCU_OSC0_XI
MCU_OSC0_XO: U12.B20(MCU_OSC0_XO) ; off-sheet MCU_OSC0_XO
MCU_PORZ: U15.4(EN) ; off-sheet MCU_PORZ
MCU_RESETSTATZ: U12.B13(MCU_RESETSTATZ) ; off-sheet MCU_RESETSTATZ
MCU_SAFETY_ERRORN: U12.A20(MCU_SAFETY_ERRORN) ; off-sheet MCU_SAFETY_ERRORN
MCU_TIMER_IO0: U12.D8(MCU_UART0_CTSN) ; off-sheet MCU_TIMER_IO0
MCU_TIMER_IO1: U12.E8(MCU_UART0_RTSN) ; off-sheet MCU_TIMER_IO1
OSPI0_CLK: P3.4 R104.1 U12.N20(OSPI0_CLK) ; off-sheet OSPI0_CLK
OSPI0_CSN0: P3.3 R69.1 U12.L19(OSPI0_CSN0) ; off-sheet OSPI0_CSN0
OSPI0_CSN1: U12.L18(OSPI0_CSN1) ; off-sheet OSPI0_CSN1
OSPI0_CSN2: U12.K17(OSPI0_CSN2) ; off-sheet OSPI0_CSN2
OSPI0_CSN3: U12.L17(OSPI0_CSN3) ; off-sheet OSPI0_CSN3
OSPI0_D0: P3.5 R103.1 U12.M19(OSPI0_D0) ; off-sheet OSPI0_D0
OSPI0_D1: P3.6 R97.1 ; off-sheet OSPI0_D1
OSPI0_D2: R96.1 ; off-sheet OSPI0_D2
OSPI0_D3: R85.1 ; off-sheet OSPI0_D3
OSPI0_DQS: U12.N19(OSPI0_DQS) ; off-sheet OSPI0_DQS
SCL: U12.A18(I2C0_SCL) ; off-sheet SCL
SDA: U12.B18(I2C0_SDA) ; off-sheet SDA
TIMER_IO0: U12.C18(I2C1_SCL) ; off-sheet TIMER_IO0
TIMER_IO1: U12.B19(I2C1_SDA) ; off-sheet TIMER_IO1
NetR69_2: R69.2 U14.1(CS#)
NetR85_2: R85.2 U14.7(HOLD#/IO3)
NetR96_2: R96.2 U14.3(WP#/IO2)
NetR97_2: R97.2 U14.2(SO/IO1)
NetR103_2: R103.2 U14.5(SI/IO0)
NetR104_2: R104.2 U14.6(SCK)

Not connected (* = marked no-connect by the designer): P3 8; U12 A7(MCU_SPI1_CS0) A8(MCU_UART0_TXD) A9(MCU_UART0_RTSN) A10(MCU_I2C0_SDA) A11(MCU_I2C1_SCL) A17(MCAN0_TX) B6(MCU_SPI0_D1) B7(MCU_SPI1_CS1) B8(MCU_UART1_CTSN) B9(MCU_UART1_RTSN) B10(MCU_I2C1_SDA) B17(MCAN0_RX) C6(MCU_SPI0_CS1) C7(MCU_SPI1_D0) C8(MCU_SPI1_D1) C9(MCU_UART1_RXD) C17(MCAN1_TX) C20(MMC1_SDWP) D6(MCU_SPI0_CS0) D7(MCU_SPI1_CLK) D9(MCU_UART1_TXD) D17(MCAN1_RX) D19(MMC1_SDCD) E6(MCU_SPI0_CLK) E7(MCU_SPI0_D0) E9(MCU_I2C0_SCL) F18(MMC0_CALPAD) G17(MMC0_DAT7) G18(MMC0_CLK) G19(MMC0_DS) H17(MMC0_DAT4) H18(MMC0_DAT6) H19(MMC0_DAT5) J17(MMC0_DAT3) J18(MMC0_DAT2) J19(MMC1_CMD) J20(MMC0_DAT1) J21(MMC0_CMD) K18(MMC1_DAT3) K19(MMC1_DAT2) K20(MMC0_DAT0) L20(MMC1_CLK) N16(GPMC0_WPN) N17(GPMC0_DIR) P16(GPMC0_ADVN_ALE) P17(GPMC0_BE0N_CLE) P19(GPMC0_CSN2) R17(GPMC0_CLK) R18(GPMC0_OEN_REN) R19(GPMC0_CSN0) R20(GPMC0_CSN1) R21(GPMC0_CSN3) T19(GPMC0_BE1N) T21(GPMC0_WEN) W19(GPMC0_WAIT0) Y18(GPMC0_WAIT1)

### Notes on the sheet
- Need to reset flash in case of interrupted interaction
- (in symbol AM6411AKCGHAALV, part B) 2 of 7

### Library data of the parts
C232 = CMP-2008-02519-2: as C78 on sheet 11-DPLL-2; Package Quantity: 1; Capacitance: 100nF; Min Operating Temperature: -55°C; Voltage: 25V; Voltage Rating: 25V; Construction: Flat; Max Operating Temperature: 125°C; Radiation Hardening: No; Depth: 0.5mm; Thickness: 0.022inch; Voltage Rating (DC): 25V; Number of Pins: 2; Lead Free: Lead Free; Series: -; REACH SVHC: No SVHC; Length: 1mm; Dielectric: X7R; RoHS Compliant: Yes; Mount: Surface Mount; Packaging: Tape and Reel; Case/Package: 0402; Case Code (Imperial): 0402; Termination: SMD/SMT; Width: 0.02inch; Case Code (Metric): 1005; Tolerance: 10%
D5 = CMP-1055-00557-1: Dual Series Cathode Schottky Barrier Diodes, 3-Pin SOT-323, Pb-Free, Tape and Reel; Manufacturer: On Semiconductor; Configuration: Common Cathode; IFSM Max (A): 0.6; trr Max (ns): 5; ComponentLink2Description: Datasheet; Packing: Tape and Reel; ComponentLink3Description: Package Specification; Mounting Technology: Surface Mount; PartNumber: BAT54CWT1G; PackageVersion: Rev. N, 11/2008; RoHS: TRUE; ComponentLink3URL: http://www.onsemi.com/pub_link/Collateral/419-04.PDF; ComponentLink2URL: http://www.onsemi.cn/pub_link/Collateral/BAT54CWT1-D.PDF; PackageReference: SOT-323-3-419-04; ComponentLink1URL: http://www.onsemi.com/; ComponentLink1Description: Manufacturer URL; DatasheetVersion: Rev. 7; PackageDescription: 3-Pin Small Outline Transistor, Body 2 x 1.25 mm, Pitch 0.65 mm
P3 = CMP-1502-01052-1: SMT Vertical Pin Header WR-PHD, Pitch 2.54 mm, Dual Row, 8 pins; Manufacturer: Wurth Elektronik; Pitch: 2.54mm; Withstanding Voltage: 500VAC; Contact Resistance: 20mOhm; Pin Number: 8; Working Voltage: 250VAC; Rated Current: 3A; Gender: Male; Publisher: WurthElektronik; Orientation: Vertical; Manufacturer URL: http://www.we-online.de; Packaging: TapeandReel; Package Reference: 61030821121; Mounting Technology: SMT; Part Number: 61030821121; Datasheet URL: https://katalog.we-online.de/em/datasheet/6103xx21121.pdf; Row Number: Dual; Operating Temperature: -40to125degC
R69 R85 R96 R97 R103 R104 = CMP-2002-08434-1: Part Number: CRCW040227R0FKED; Manufacturer: Vishay Dale
R105 = CMP-2002-04569-1: as R79 on sheet 11-DPLL-2
U12 = AM6411AKCGHAALV: as U12 on sheet 12-AM64x-01; RefDes: RefDes; Type: Type
U14 = CMP-2000-07017-1: SPI Flash Memory, 2.7 to 3.6 V, -40 to 85 degC, 8-Pin WSON, RoHS, Tube; Manufacturer: CypressSemiconductorCorp; Interface: SPISerial; Voltage - Supply: 2.7V~3.6V; Memory Type: FLASH-NOR; Speed: 133MHz; Memory Size: 256M(32Mx8); Supplier Device Package: 8-WSON(6x8); Operating Temperature: -40°C~85°C(TA); Package Description: 8-Pin Small Outline No-lead Package, Body 6 x 8 mm, Pitch 1.27 mm; Series: FL-S; Datasheet Version: Rev. *I, 08/2015; Package Reference: WSON-8; Datasheet URL: http://www.spansion.com/Support/Datasheets/S25FL128S_256S_00.pdf; Packaging: Tube; Manufacturer URL: http://www.cypress.com/; Package / Case: 8-WDFNExposedPad; Format - Memory: FLASH; Family: Memory; Mounting Technology: SurfaceMount; Category: IntegratedCircuits(ICs)
U15 = CMP-06317-000053-1: IC PWR SWITCH P-CHAN 1:1 4TMLF; Turn-On Delay Time: 1.5us; Turn-Off Delay Time: 200ns; On-State Resistance: 67mR; Output Current: 2A; Min Supply Voltage: 1.7V; Number of Outputs: 1; Interface: On/Off; Output Configuration: High Side; Max Supply Voltage: 5.5V; Radiation Hardening: No; Min Operating Temperature: -40°C; Mount: Surface Mount; Series: -; RoHS Compliant: Yes; Number of Pins: 4; Reach SVHC Compliant: Yes; On-state Resistance-Max: 67MR; Package Quantity: 5000; Packaging: Tape and Reel; Max Output Current: 2A; Supply Current: 2A; Lead Free: Lead Free; Current Rating: 2A; Max Operating Temperature: 125°C; Rated Current-Max: 2A; Nominal Supply Current: 2A

## Sheet 14-AM64x-03.SchDoc
size B; SheetNumber: 14; SheetTotal: 25
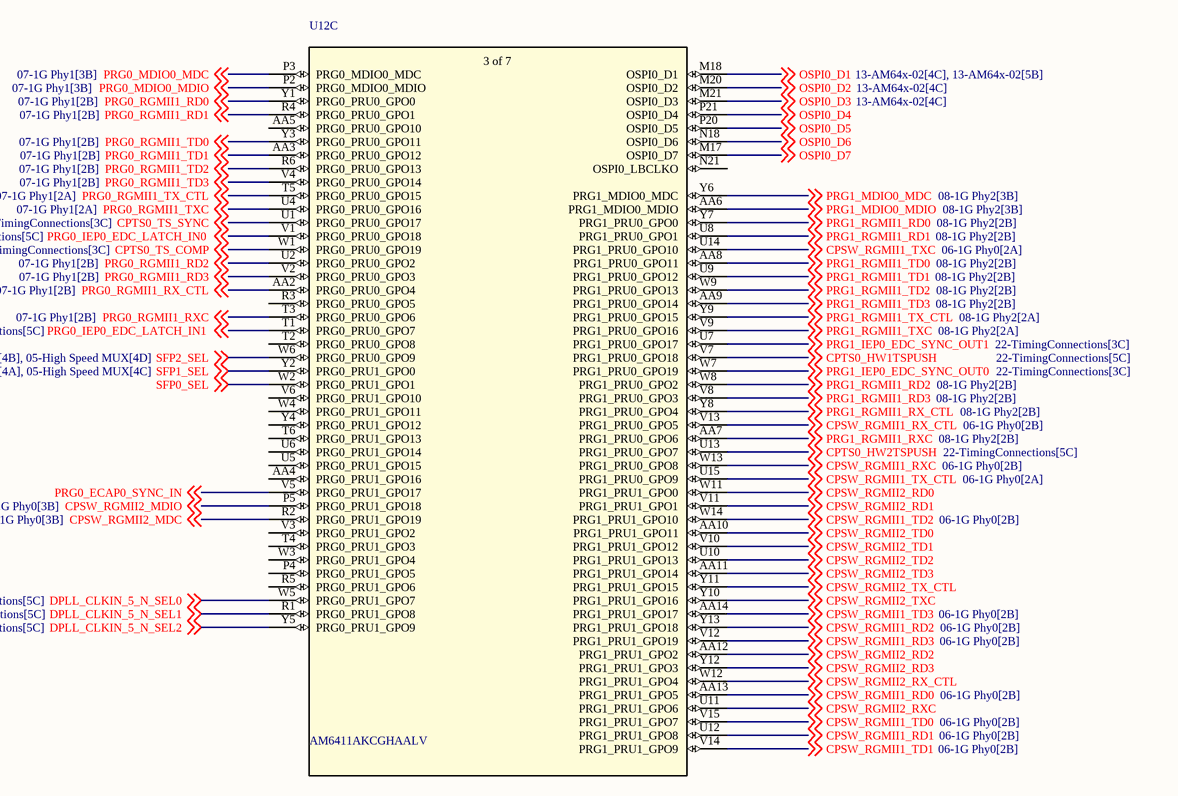
[diagram p13: 14-AM64x-03.SchDoc]

### Parts
U12  AM6411AKCGHAALV  [FCBGA441_ALV_TEX]  (part C of 7)

### Nets
CPSW_RGMII1_RD0: U12.AA13(PRG1_PRU1_GPO5) ; off-sheet CPSW_RGMII1_RD0
CPSW_RGMII1_RD1: U12.U12(PRG1_PRU1_GPO8) ; off-sheet CPSW_RGMII1_RD1
CPSW_RGMII1_RD2: U12.Y13(PRG1_PRU1_GPO18) ; off-sheet CPSW_RGMII1_RD2
CPSW_RGMII1_RD3: U12.V12(PRG1_PRU1_GPO19) ; off-sheet CPSW_RGMII1_RD3
CPSW_RGMII1_RX_CTL: U12.V13(PRG1_PRU0_GPO5) ; off-sheet CPSW_RGMII1_RX_CTL
CPSW_RGMII1_RXC: U12.W13(PRG1_PRU0_GPO8) ; off-sheet CPSW_RGMII1_RXC
CPSW_RGMII1_TD0: U12.V15(PRG1_PRU1_GPO7) ; off-sheet CPSW_RGMII1_TD0
CPSW_RGMII1_TD1: U12.V14(PRG1_PRU1_GPO9) ; off-sheet CPSW_RGMII1_TD1
CPSW_RGMII1_TD2: U12.W14(PRG1_PRU1_GPO10) ; off-sheet CPSW_RGMII1_TD2
CPSW_RGMII1_TD3: U12.AA14(PRG1_PRU1_GPO17) ; off-sheet CPSW_RGMII1_TD3
CPSW_RGMII1_TX_CTL: U12.U15(PRG1_PRU0_GPO9) ; off-sheet CPSW_RGMII1_TX_CTL
CPSW_RGMII1_TXC: U12.U14(PRG1_PRU0_GPO10) ; off-sheet CPSW_RGMII1_TXC
CPSW_RGMII2_MDC: U12.R2(PRG0_PRU1_GPO19) ; off-sheet CPSW_RGMII2_MDC
CPSW_RGMII2_MDIO: U12.P5(PRG0_PRU1_GPO18) ; off-sheet CPSW_RGMII2_MDIO
CPSW_RGMII2_RD0: U12.W11(PRG1_PRU1_GPO0) ; off-sheet CPSW_RGMII2_RD0
CPSW_RGMII2_RD1: U12.V11(PRG1_PRU1_GPO1) ; off-sheet CPSW_RGMII2_RD1
CPSW_RGMII2_RD2: U12.AA12(PRG1_PRU1_GPO2) ; off-sheet CPSW_RGMII2_RD2
CPSW_RGMII2_RD3: U12.Y12(PRG1_PRU1_GPO3) ; off-sheet CPSW_RGMII2_RD3
CPSW_RGMII2_RX_CTL: U12.W12(PRG1_PRU1_GPO4) ; off-sheet CPSW_RGMII2_RX_CTL
CPSW_RGMII2_RXC: U12.U11(PRG1_PRU1_GPO6) ; off-sheet CPSW_RGMII2_RXC
CPSW_RGMII2_TD0: U12.AA10(PRG1_PRU1_GPO11) ; off-sheet CPSW_RGMII2_TD0
CPSW_RGMII2_TD1: U12.V10(PRG1_PRU1_GPO12) ; off-sheet CPSW_RGMII2_TD1
CPSW_RGMII2_TD2: U12.U10(PRG1_PRU1_GPO13) ; off-sheet CPSW_RGMII2_TD2
CPSW_RGMII2_TD3: U12.AA11(PRG1_PRU1_GPO14) ; off-sheet CPSW_RGMII2_TD3
CPSW_RGMII2_TX_CTL: U12.Y11(PRG1_PRU1_GPO15) ; off-sheet CPSW_RGMII2_TX_CTL
CPSW_RGMII2_TXC: U12.Y10(PRG1_PRU1_GPO16) ; off-sheet CPSW_RGMII2_TXC
CPTS0_HW1TSPUSH: U12.V7(PRG1_PRU0_GPO18) ; off-sheet CPTS0_HW1TSPUSH
CPTS0_HW2TSPUSH: U12.U13(PRG1_PRU0_GPO7) ; off-sheet CPTS0_HW2TSPUSH
CPTS0_TS_COMP: U12.W1(PRG0_PRU0_GPO19) ; off-sheet CPTS0_TS_COMP
CPTS0_TS_SYNC: U12.U1(PRG0_PRU0_GPO17) ; off-sheet CPTS0_TS_SYNC
DPLL_CLKIN_5_N_SEL0: U12.W5(PRG0_PRU1_GPO7) ; off-sheet DPLL_CLKIN_5_N_SEL0
DPLL_CLKIN_5_N_SEL1: U12.R1(PRG0_PRU1_GPO8) ; off-sheet DPLL_CLKIN_5_N_SEL1
DPLL_CLKIN_5_N_SEL2: U12.Y5(PRG0_PRU1_GPO9) ; off-sheet DPLL_CLKIN_5_N_SEL2
OSPI0_D1: U12.M18(OSPI0_D1) ; off-sheet OSPI0_D1
OSPI0_D2: U12.M20(OSPI0_D2) ; off-sheet OSPI0_D2
OSPI0_D3: U12.M21(OSPI0_D3) ; off-sheet OSPI0_D3
OSPI0_D4: U12.P21(OSPI0_D4) ; off-sheet OSPI0_D4
OSPI0_D5: U12.P20(OSPI0_D5) ; off-sheet OSPI0_D5
OSPI0_D6: U12.N18(OSPI0_D6) ; off-sheet OSPI0_D6
OSPI0_D7: U12.M17(OSPI0_D7) ; off-sheet OSPI0_D7
PRG0_ECAP0_SYNC_IN: U12.V5(PRG0_PRU1_GPO17) ; off-sheet PRG0_ECAP0_SYNC_IN
PRG0_IEP0_EDC_LATCH_IN0 : U12.V1(PRG0_PRU0_GPO18) ; off-sheet PRG0_IEP0_EDC_LATCH_IN0   [project net PRG0_IEP0_EDC_LATCH_IN0]
PRG0_IEP0_EDC_LATCH_IN1 : U12.T1(PRG0_PRU0_GPO7) ; off-sheet PRG0_IEP0_EDC_LATCH_IN1   [project net PRG0_IEP0_EDC_LATCH_IN1]
PRG0_MDIO0_MDC: U12.P3(PRG0_MDIO0_MDC) ; off-sheet PRG0_MDIO0_MDC
PRG0_MDIO0_MDIO: U12.P2(PRG0_MDIO0_MDIO) ; off-sheet PRG0_MDIO0_MDIO
PRG0_RGMII1_RD0: U12.Y1(PRG0_PRU0_GPO0) ; off-sheet PRG0_RGMII1_RD0
PRG0_RGMII1_RD1: U12.R4(PRG0_PRU0_GPO1) ; off-sheet PRG0_RGMII1_RD1
PRG0_RGMII1_RD2: U12.U2(PRG0_PRU0_GPO2) ; off-sheet PRG0_RGMII1_RD2
PRG0_RGMII1_RD3: U12.V2(PRG0_PRU0_GPO3) ; off-sheet PRG0_RGMII1_RD3
PRG0_RGMII1_RX_CTL: U12.AA2(PRG0_PRU0_GPO4) ; off-sheet PRG0_RGMII1_RX_CTL
PRG0_RGMII1_RXC: U12.T3(PRG0_PRU0_GPO6) ; off-sheet PRG0_RGMII1_RXC
PRG0_RGMII1_TD0: U12.Y3(PRG0_PRU0_GPO11) ; off-sheet PRG0_RGMII1_TD0
PRG0_RGMII1_TD1: U12.AA3(PRG0_PRU0_GPO12) ; off-sheet PRG0_RGMII1_TD1
PRG0_RGMII1_TD2: U12.R6(PRG0_PRU0_GPO13) ; off-sheet PRG0_RGMII1_TD2
PRG0_RGMII1_TD3: U12.V4(PRG0_PRU0_GPO14) ; off-sheet PRG0_RGMII1_TD3
PRG0_RGMII1_TX_CTL: U12.T5(PRG0_PRU0_GPO15) ; off-sheet PRG0_RGMII1_TX_CTL
PRG0_RGMII1_TXC: U12.U4(PRG0_PRU0_GPO16) ; off-sheet PRG0_RGMII1_TXC
PRG1_IEP0_EDC_SYNC_OUT0: U12.W7(PRG1_PRU0_GPO19) ; off-sheet PRG1_IEP0_EDC_SYNC_OUT0
PRG1_IEP0_EDC_SYNC_OUT1: U12.U7(PRG1_PRU0_GPO17) ; off-sheet PRG1_IEP0_EDC_SYNC_OUT1
PRG1_MDIO0_MDC: U12.Y6(PRG1_MDIO0_MDC) ; off-sheet PRG1_MDIO0_MDC
PRG1_MDIO0_MDIO: U12.AA6(PRG1_MDIO0_MDIO) ; off-sheet PRG1_MDIO0_MDIO
PRG1_RGMII1_RD0: U12.Y7(PRG1_PRU0_GPO0) ; off-sheet PRG1_RGMII1_RD0
PRG1_RGMII1_RD1: U12.U8(PRG1_PRU0_GPO1) ; off-sheet PRG1_RGMII1_RD1
PRG1_RGMII1_RD2: U12.W8(PRG1_PRU0_GPO2) ; off-sheet PRG1_RGMII1_RD2
PRG1_RGMII1_RD3: U12.V8(PRG1_PRU0_GPO3) ; off-sheet PRG1_RGMII1_RD3
PRG1_RGMII1_RX_CTL: U12.Y8(PRG1_PRU0_GPO4) ; off-sheet PRG1_RGMII1_RX_CTL
PRG1_RGMII1_RXC: U12.AA7(PRG1_PRU0_GPO6) ; off-sheet PRG1_RGMII1_RXC
PRG1_RGMII1_TD0: U12.AA8(PRG1_PRU0_GPO11) ; off-sheet PRG1_RGMII1_TD0
PRG1_RGMII1_TD1: U12.U9(PRG1_PRU0_GPO12) ; off-sheet PRG1_RGMII1_TD1
PRG1_RGMII1_TD2: U12.W9(PRG1_PRU0_GPO13) ; off-sheet PRG1_RGMII1_TD2
PRG1_RGMII1_TD3: U12.AA9(PRG1_PRU0_GPO14) ; off-sheet PRG1_RGMII1_TD3
PRG1_RGMII1_TX_CTL: U12.Y9(PRG1_PRU0_GPO15) ; off-sheet PRG1_RGMII1_TX_CTL
PRG1_RGMII1_TXC: U12.V9(PRG1_PRU0_GPO16) ; off-sheet PRG1_RGMII1_TXC
SFP0_SEL: U12.W2(PRG0_PRU1_GPO1) ; off-sheet SFP0_SEL
SFP1_SEL: U12.Y2(PRG0_PRU1_GPO0) ; off-sheet SFP1_SEL
SFP2_SEL: U12.W6(PRG0_PRU0_GPO9) ; off-sheet SFP2_SEL

Not connected (* = marked no-connect by the designer): U12 AA4(PRG0_PRU1_GPO16) AA5(PRG0_PRU0_GPO10) N21(OSPI0_LBCLKO) P4(PRG0_PRU1_GPO5) R3(PRG0_PRU0_GPO5) R5(PRG0_PRU1_GPO6) T2(PRG0_PRU0_GPO8) T4(PRG0_PRU1_GPO3) T6(PRG0_PRU1_GPO13) U5(PRG0_PRU1_GPO15) U6(PRG0_PRU1_GPO14) V3(PRG0_PRU1_GPO2) V6(PRG0_PRU1_GPO10) W3(PRG0_PRU1_GPO4) W4(PRG0_PRU1_GPO11) Y4(PRG0_PRU1_GPO12)

### Notes on the sheet
- (in symbol AM6411AKCGHAALV, part C) 3 of 7

### Library data of the parts
U12 = AM6411AKCGHAALV: as U12 on sheet 12-AM64x-01; RefDes: RefDes; Type: Type

## Sheet 15-AM64x-04.SchDoc
size B; SheetNumber: 15; SheetTotal: 25
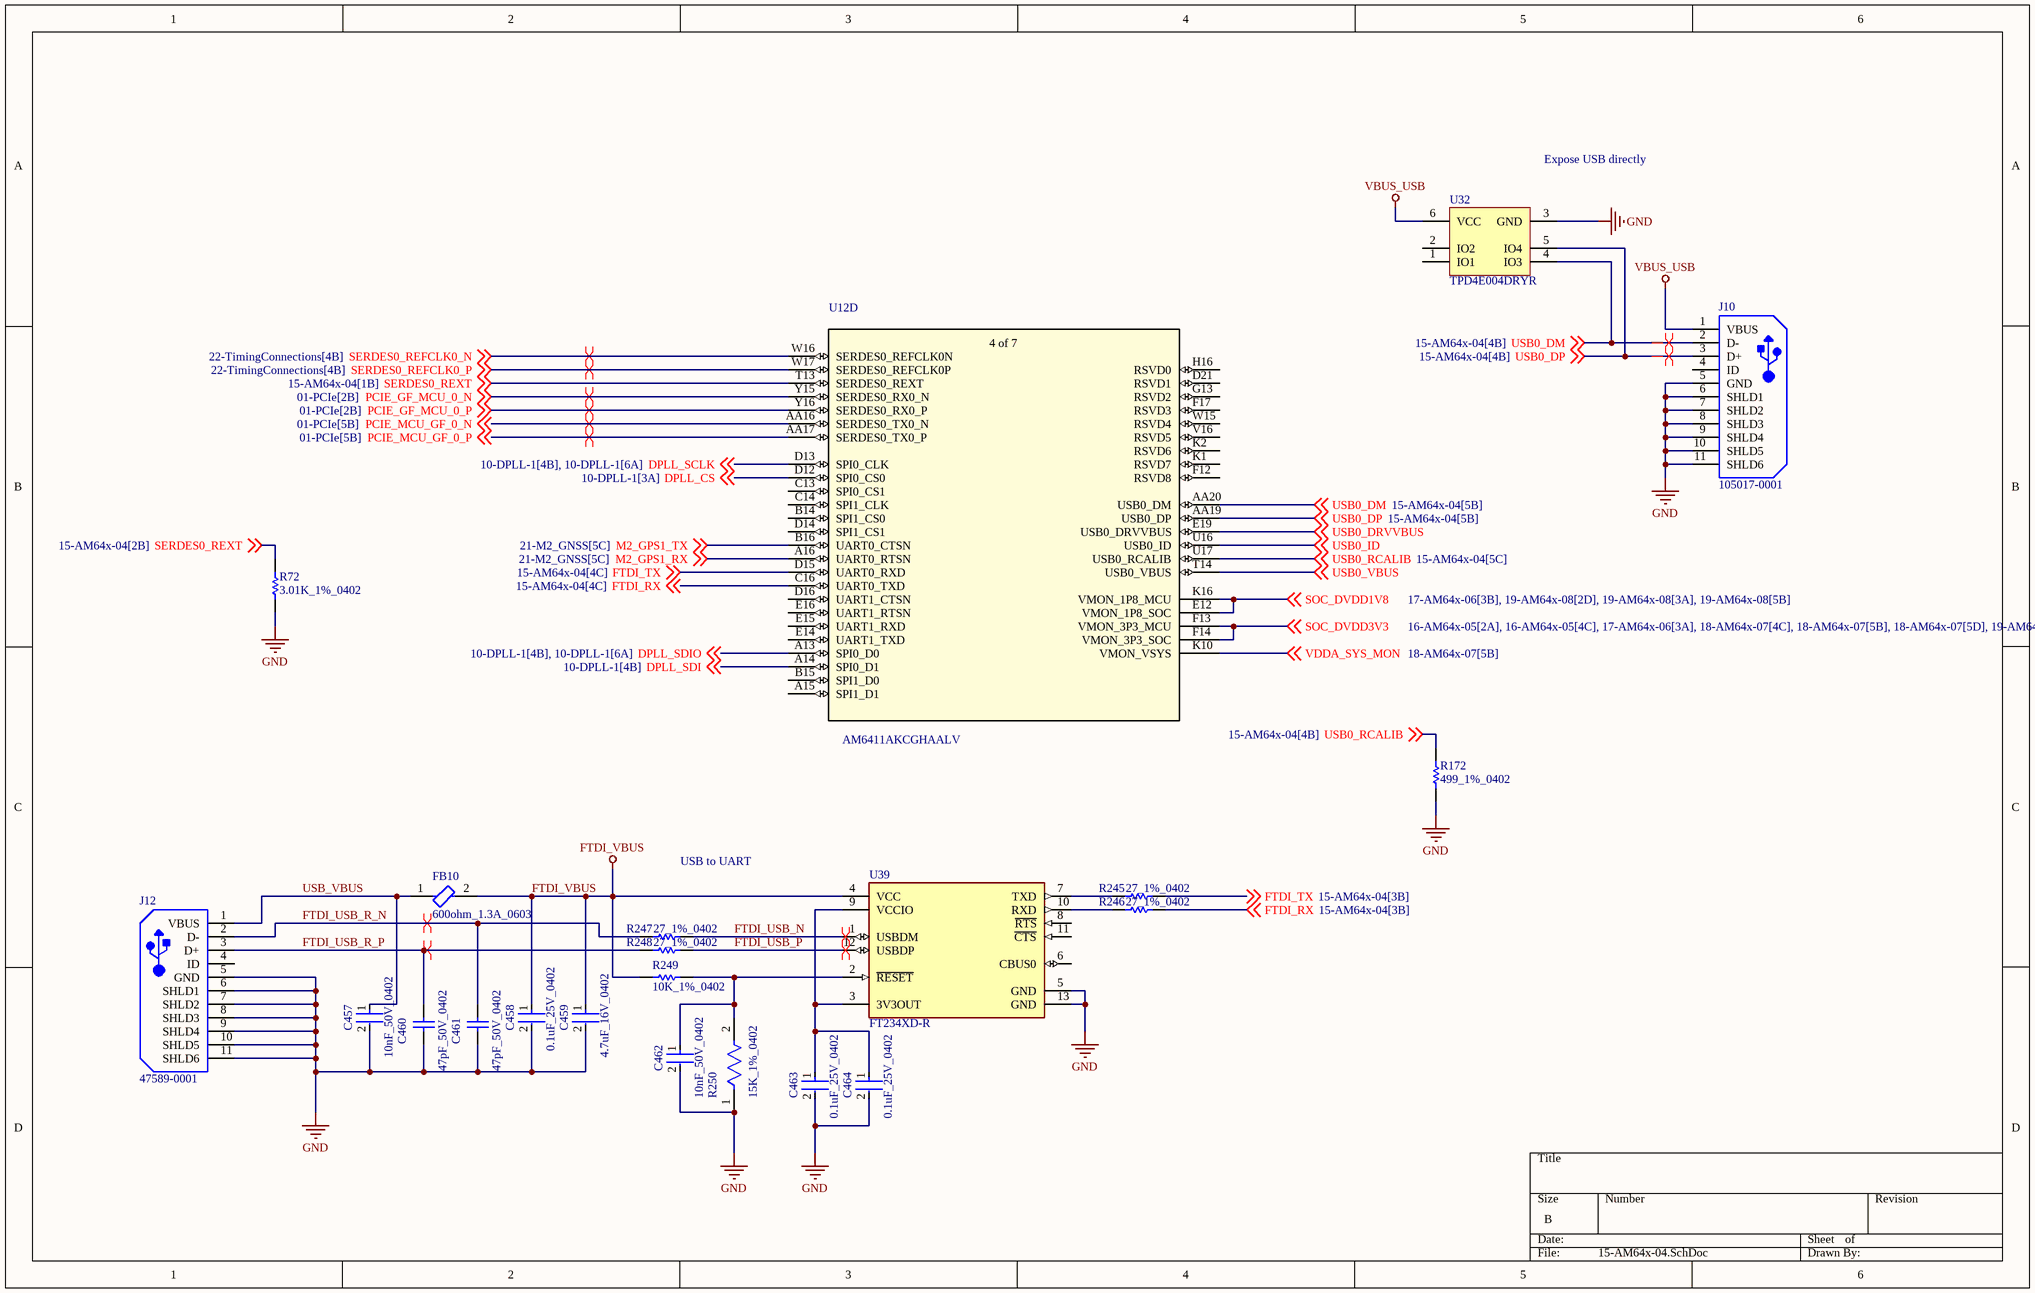
[diagram p14: 15-AM64x-04.SchDoc]

### Parts
C457  10nF_50V_0402  [FP-CC0402-MFG]
C458  0.1uF_25V_0402  [FP-0402-L_1_0_1-W_0_5_0_1-IPC_C]
C459  4.7uF_16V_0402  [FP-CL829-IPC_C]
C460  47pF_50V_0402  [CAPC1005X55X25LL05T10]
C461  47pF_50V_0402  [CAPC1005X55X25LL05T10]
C462  10nF_50V_0402  [FP-CC0402-MFG]
C463  0.1uF_25V_0402  [FP-0402-L_1_0_1-W_0_5_0_1-IPC_C]
C464  0.1uF_25V_0402  [FP-0402-L_1_0_1-W_0_5_0_1-IPC_C]
FB10  600ohm_1.3A_0603  [FP-BLM18-0_15-t0_8-IPC_A]
J10  105017-0001  [USB-MICRO-B_V]
J12  47589-0001  [MOLX-47589-0001_V]
R72  3.01K_1%_0402  [RESC1005X40X25LL05T10]
R172  499_1%_0402  [RESC1005X40X25LL05T05]
R245  27_1%_0402  [RESC1005X40X25NL05T05]
R246  27_1%_0402  [RESC1005X40X25NL05T05]
R247  27_1%_0402  [RESC1005X40X25NL05T05]
R248  27_1%_0402  [RESC1005X40X25NL05T05]
R249  10K_1%_0402  [RESC1005X40X25LL05T10]
R250  15K_1%_0402  [FP-ERJ2R-MFG]
U12  AM6411AKCGHAALV  [FCBGA441_ALV_TEX]  (part D of 7)
U32  TPD4E004DRYR  [DRY0006A]
U39  FT234XD-R  [FP-DFN-12-IPC_B]

### Nets
FTDI_VBUS: C458.1 C459.1 FB10.2 R249.2 U39.4(VCC)
GND: C457.2 C458.2 C459.2 C460.1 C461.1 C462.2 C463.2 C464.2 J10.5(GND) J10.6(SHLD1) J10.7(SHLD2) J10.8(SHLD3) J10.9(SHLD4) J10.10(SHLD5) J10.11(SHLD6) J12.5(GND) J12.6(SHLD1) J12.7(SHLD2) J12.8(SHLD3) J12.9(SHLD4) J12.10(SHLD5) J12.11(SHLD6) R72.1 R172.1 R250.1 U32.3(GND) U39.5(GND) U39.13(GND)
VBUS_USB: J10.1(VBUS) U32.6(VCC)
DPLL_CS: U12.D12(SPI0_CS0) ; off-sheet DPLL_CS
DPLL_SCLK: U12.D13(SPI0_CLK) ; off-sheet DPLL_SCLK
DPLL_SDI: U12.A14(SPI0_D1) ; off-sheet DPLL_SDI
DPLL_SDIO: U12.A13(SPI0_D0) ; off-sheet DPLL_SDIO
FTDI_RX: R246.2 U12.C16(UART0_TXD) ; off-sheet FTDI_RX
FTDI_TX: R245.2 U12.D15(UART0_RXD) ; off-sheet FTDI_TX
FTDI_USB_N: R247.2 U39.1(USBDM)
FTDI_USB_P: R248.2 U39.12(USBDP)
FTDI_USB_R_N: C461.2 J12.2(D-) R247.1
FTDI_USB_R_P: C460.2 J12.3(D+) R248.1
M2_GPS1_RX: U12.A16(UART0_RTSN) ; off-sheet M2_GPS1_RX
M2_GPS1_TX: U12.B16(UART0_CTSN) ; off-sheet M2_GPS1_TX
PCIE_GF_MCU_0_N: U12.Y15(SERDES0_RX0_N) ; off-sheet PCIE_GF_MCU_0_N
PCIE_GF_MCU_0_P: U12.Y16(SERDES0_RX0_P) ; off-sheet PCIE_GF_MCU_0_P
PCIE_MCU_GF_0_N: U12.AA16(SERDES0_TX0_N) ; off-sheet PCIE_MCU_GF_0_N
PCIE_MCU_GF_0_P: U12.AA17(SERDES0_TX0_P) ; off-sheet PCIE_MCU_GF_0_P
SERDES0_REFCLK0_N: U12.W16(SERDES0_REFCLK0N) ; off-sheet SERDES0_REFCLK0_N
SERDES0_REFCLK0_P: U12.W17(SERDES0_REFCLK0P) ; off-sheet SERDES0_REFCLK0_P
SERDES0_REXT: R72.2 U12.T13(SERDES0_REXT) ; off-sheet SERDES0_REXT
SOC_DVDD1V8: U12.E12(VMON_1P8_SOC) U12.K16(VMON_1P8_MCU) ; off-sheet SOC_DVDD1V8
SOC_DVDD3V3: U12.F13(VMON_3P3_MCU) U12.F14(VMON_3P3_SOC) ; off-sheet SOC_DVDD3V3
USB0_DM: J10.2(D-) U12.AA20(USB0_DM) U32.4(IO3) ; off-sheet USB0_DM
USB0_DP: J10.3(D+) U12.AA19(USB0_DP) U32.5(IO4) ; off-sheet USB0_DP
USB0_DRVVBUS: U12.E19(USB0_DRVVBUS) ; off-sheet USB0_DRVVBUS
USB0_ID: U12.U16(USB0_ID) ; off-sheet USB0_ID
USB0_RCALIB: R172.2 U12.U17(USB0_RCALIB) ; off-sheet USB0_RCALIB
USB0_VBUS: U12.T14(USB0_VBUS) ; off-sheet USB0_VBUS
USB_VBUS: C457.1 FB10.1 J12.1(VBUS)
VDDA_SYS_MON: U12.K10(VMON_VSYS) ; off-sheet VDDA_SYS_MON
NetC462_1: C462.1 R249.1 R250.2 U39.2(~{RESET})
NetC463_1: C463.1 C464.1 U39.3(3V3OUT) U39.9(VCCIO)
NetR245_1: R245.1 U39.7(TXD)
NetR246_1: R246.1 U39.10(RXD)

Not connected (* = marked no-connect by the designer): J10 4(ID); J12 4(ID); U12 A15(SPI1_D1) B14(SPI1_CS0) B15(SPI1_D0) C13(SPI0_CS1) C14(SPI1_CLK) D14(SPI1_CS1) D16(UART1_CTSN) D21(RSVD1) E14(UART1_TXD) E15(UART1_RXD) E16(UART1_RTSN) F12(RSVD8) F17(RSVD3) G13(RSVD2) H16(RSVD0) K1(RSVD7) K2(RSVD6) V16(RSVD5) W15(RSVD4); U32 1(IO1) 2(IO2); U39 6(CBUS0) 8(~{RTS}) 11(~{CTS})

### Layout directives
differential pair: FTDI_USB_N, FTDI_USB_P, FTDI_USB_R_N, FTDI_USB_R_P, PCIE_GF_MCU_0_N, PCIE_GF_MCU_0_P, PCIE_MCU_GF_0_N, PCIE_MCU_GF_0_P, SERDES0_REFCLK0_N, SERDES0_REFCLK0_P, USB0_DM, USB0_DP

### Notes on the sheet
- Expose USB directly
- USB to UART
- (in symbol AM6411AKCGHAALV, part D) 4 of 7

### Library data of the parts
C457 C462 = CMP-2100-03592-2: CAP CER 10000PF 50V X7R 0402; Manufacturer Part Number: CC0402KRX7R9BB103; Manufacturer: YAGEO; Temperature Coefficient: 30ppm/°C; Capacitance: 10 nF; Material: Ceramic; Automotive Grade: NA; Tolerance: 0.1; Value: 10 nF; Device Class L3: Ceramic Capacitors; Temperature: -55°C to +125°C; Footprint Url: http://www.yageo.com/exep/pages/download/literatures/UPY-C_GEN_24.pdf; Ipc Land Pattern Name: CAPC10050X50; Device Class L1: Passive Components; Automotive: No; Octopart: https://octopart.com/cc0402krx7r9bb103-yageo-8376513; Lead Free: Yes; Temperature Range Low: -55°C; Height: 0.55mm; ComponentLink2URL: http://www.yageo.com/documents/recent/UPY-GP_NP0_16V-to-50V_16.pdf; Category: Cap; ComponentLink2Description: Datasheet; Temperature Range High: +125°C; Digikey Description: CAP CER 10000PF 50V X7R 0402; Voltage Rating: 50 V; Package: CC0402; Device Class L2: Capacitors; Mouser Description: 0402 10 nF 50 V ±10 % Tolerance X7R SMT Multilayer Ceramic Capacitor; RoHS: TRUE; Temperature Characteristic: X7R
C458 C463 C464 = CMP-2008-02519-2: as C78 on sheet 11-DPLL-2; Package Quantity: 1; Capacitance: 100nF; Min Operating Temperature: -55°C; Voltage: 25V; Voltage Rating: 25V; Construction: Flat; Max Operating Temperature: 125°C; Radiation Hardening: No; Depth: 0.5mm; Thickness: 0.022inch; Voltage Rating (DC): 25V; Number of Pins: 2; Lead Free: Lead Free; Series: -; REACH SVHC: No SVHC; Length: 1mm; Dielectric: X7R; RoHS Compliant: Yes; Mount: Surface Mount; Packaging: Tape and Reel; Case/Package: 0402; Case Code (Imperial): 0402; Termination: SMD/SMT; Width: 0.02inch; Case Code (Metric): 1005; Tolerance: 10%
C459 = CMP-13271-001468-1: Cap Ceramic 4.7uF 16V X5R ±20% SMD 0402 +85°C Paper T/R; Mount: Surface Mount; Case Code (Metric): 1005; Case/Package: 0402; Length: 0.039inch; Capacitance: 4.7uF; Voltage Rating: 16V; Max Operating Temperature: 85°C; Tolerance: 20%; Thickness: 0.022inch; Min Operating Temperature: -55°C; Case Code (Imperial): 0402; Packaging: Tape and Reel; Width: 0.02inch
C460 C461 = CMP-2008-04368-1: Part Number: GRM1555C1H470JA01D; Manufacturer: Murata
FB10 = CMP-0686-00581-3: Chip Ferrite Bead, 0603, 600Ω @ 100MHz, 0.15Ω, 25%, 1.3A; Material: Steel; Number of Lines: 1; Impedance: 600R; DC Resistance (DCR): 150mR; Tolerance: 25%; Case Code (Metric): 1608; Width: 0.8mm; DC Current: 1.3A; Max DC Current: 1.3A; Package Quantity: 1; Number of Pins: 2; Military Standard: Not; RoHS Compliant: Yes; Termination: SMD/SMT; Max Operating Temperature: 125°C; Length: 1.6mm; Depth: 0.8mm; Case Code (Imperial): 0603; Series: BLM18K; Inductor Type: FERRITE BEAD; Core Material: Ferrite; Number of Circuits: 1; Height: 0.8mm; Case/Package: 0603; REACH SVHC: No SVHC; Packaging: Tape and Reel; Min Operating Temperature: -55°C; Max Current Rating: 1.3A; Radiation Hardening: No; Current Rating: 1.3A; Lead Free: Lead Free; Test Frequency: 100MHz; Weight: 7.1E-05oz
J10 = CMP-2000-05827-1: Micro-USB B Receptacle, Right Angle, Bottom Mount, Surface Mount, with Solder Tabs, -30 to 85 degC, 5-Pin USB, RoHS, Tape and Reel; Manufacturer: Molex; Featured Product: Micro-USBConnectorsUSBConnectors; Other Names: WM1399DKR; Package Version: Rev. F, 12/2012; Number of Contacts: 5; Connector Type: USB-microB; Catalog Drawings: 1050170001; 3D Model: 105017-0001.stp; Mating Products: WM17145-ND-CABLEMICROUSBBTOSTDA1.0MWM17147-ND-CABLEMICROUSBBTOSTDA2.0MWM17146-ND-CABLEMICROUSBBTOSTDA1.5M; PCN Assembly/Origin: ResinSupplier21/Oct/2015; Voltage - Max: 30V; Online Catalog: Molex-MicroUSB; Manufacturer URL: http://www.molex.com/; Package Description: 5-Leads USB, Micro B, Body 7.5 x 5 mm, Pitch 0.65 mm; Datasheet URL: http://www.molex.com/elqNow/elqRedir.htm?ref=http://www.molex.com/webdocs/datasheets/pdf/en-us/1050170001_IO_CONNECTORS.pdf; Ingress Protection: -; Datasheet Version: 03/2016; Mounting Type: BoardCutout,SurfaceMount,RightAngle; Circuits: 5; Standard Package: 1; Package Reference: MICRO-B; Package URL: http://www.molex.com/pdm_docs/sd/1050170001_sd.pdf; Category: Connectors,Interconnects; Series: -; RoHS Information: 1050170001CertofCompliance; Features: Shielded,SolderRetention; Family: USB,DVI,HDMIConnectors; Specifications: -; Gender: Receptacle; Packaging: Digi-Reel®; Mounting Technology: SurfaceMount
J12 = CMP-2000-05610-1: Right Angle Female Type AB Micro USB Connector, 30 V, 1.8 A, -30 to 85 degC, RoHS, Tape and Reel; Number of Ports: 1Port; Current Rating: 1.8A; Brand: Molex; Connector Type: MicroUSBTypeABreceptacle; Number of Contacts: 5Contact; Voltage Rating: 30VAC; Color: Black; Product: MicroUSBTypeABConnectors; Package URL: http://www.molex.com/pdm_docs/sd/475890001_sd.pdf; Contact Plating: Gold; Datasheet URL: http://www.molex.com/webdocs/datasheets/pdf/en-us/0475890001_IO_CONNECTORS.pdf; Operating Temperature Range: -20Cto+85C; Termination Style: SMD/SMT; Mounting Angle: Right; Package Reference: 47589-0001; Gender: Female; Package Description: Micro USB Connector, Pitch 0.65 mm, 5 Positions, Body 7.5 x 5.6 mm; Mounting Technology: SurfaceMount; Contact Material: CopperAlloy; Packaging: Reel; RoHS: True; Standard: USB; Manufacturer URL: http://www.molex.com/; Manufacturer: Molex; Datasheet Version: 12/2016; Product Category: USBConnectors; Series: 47589
R72 = CMP-2002-07883-1: Manufacturer: Yageo; Part Number: RC0402FR-133K01L
R172 = CMP-2002-00038-1: Manufacturer: Vishay Dale; Part Number: CRCW0402499RFKTD
R245-R248 = CMP-2002-08434-1: as R69 on sheet 13-AM64x-02
R249 = CMP-2002-07353-1: Part Number: RC0402FR-0710KL; Manufacturer: Yageo / Phycomp
R250 = CMP-2002-00694-4: RES SMD 15K OHM 1% 1/10W 0402; Manufacturer Part Number: ERJ-2RKF1502X; Manufacturer: Panasonic; Automotive Grade: Grade 0; Voltage Rating: 50V; Resistance: 15kΩ; Temperature Coefficient: 100ppm/°C; Power Rating: 0.1W; Value: 15kΩ; ComponentLink2URL: https://industrial.panasonic.com/cdbs/www-data/pdf/RDA0000/AOA0000C304.pdf; Automotive: Yes; Temperature: -55°C to +155°C; Height: 0.4mm; Digikey Description: RES SMD 15K OHM 1% 1/10W 0402; Category: Res; Device Class L2: Resistors; Device Class L1: Passive Components; Package: ERJ2R; Temperature Range Low: -55°C; Tolerance: 1%; Series: ERJ; Footprint Url: https://b2b-api.panasonic.eu/file_stream/pids/fileversion/1180; Mouser Description: Res Thick Film 1.0 x 0.5 mm 15K Ohm 1% 0.1W(1/10W) 100ppm/ C Molded SMD Punched Carrier T/R; Composition: Thick Film; Lead Free: Yes; Device Class L3: Chip SMD Resistors; Octopart: https://octopart.com/erj-2rkf1502x-panasonic-55404985; RoHS: TRUE; Temperature Range High: +155°C; ComponentLink2Description: Datasheet
U12 = AM6411AKCGHAALV: as U12 on sheet 12-AM64x-01; RefDes: RefDes; Type: Type
U32 = CMP-0326-00024-3: ESD-Protection Array for High-Speed Data Interfaces, 4 Channels, -40 to +85 degC, 6-pin SON (DRY), Green (RoHS & no Sb/Br); Manufacturer: Texas Instruments; USB High Speed: TRUE; IO Capacitance(Typ)(pF): 1.6; IEC 61000-4-2 Air-Gap(+/- kV): 12; SubFamily: ESD Solution; IO Leakage Current(nA): 1; Breakdown Voltage(Min)(V): 6; IEC 61000-4-2 Contact(+/- kV): 8; ComponentLink3Description: URL Link1; ComponentLink3URL: SamplesURL:http://www.ti.com/product/tpd4e004#samples; PackageReference: DRY0006A; ComponentLink2URL: http://www.ti.com/general/docs/lit/getliterature.tsp?genericPartNumber=TPD4E004&fileType=pdf; ComponentLink2Description: Datasheet; DatasheetVersion: SLVS729A; ComponentLink1Description: Manufacturer URL; PackageDescription: 6-Pin Plastic Small Outline No-Lead, 1 x 1.45 x 0.6 mm Body, 0.5 mm Pitch; 1394 / Firewire: TRUE; Serial ATA / eSATA: TRUE; Eco-Plan: Green (RoHS & no Sb/Br); ComponentLink1URL: http://www.ti.com/; PackageVersion: revF, Dec-2011; Mounting Technology: Surface Mount; PartNumber: TPD4E004DRYR
U39 = CMP-0248-00027-3: IC USB SERIAL BASIC UART 12DFN; Min Supply Voltage: 2.97V; Number of Ports: 1; Operating Supply Voltage: 5V; Operating Supply Current: 8mA; Max Supply Voltage: 5.5V; Data Rate: 3Mbps; Length: 3mm; Case/Package: DFN; Mount: Surface Mount; Packaging: Tape and Reel; Max Operating Temperature: 85°C; Height: 0.75mm; Number of Pins: 12; Number of Transceivers: 1; Package Quantity: 5000; Min Operating Temperature: -40°C; Width: 3mm; REACH SVHC: No SVHC; Interface: UART; Lead Free: Lead Free

## Sheet 16-AM64x-05.SchDoc
size B; SheetNumber: 16; SheetTotal: 25
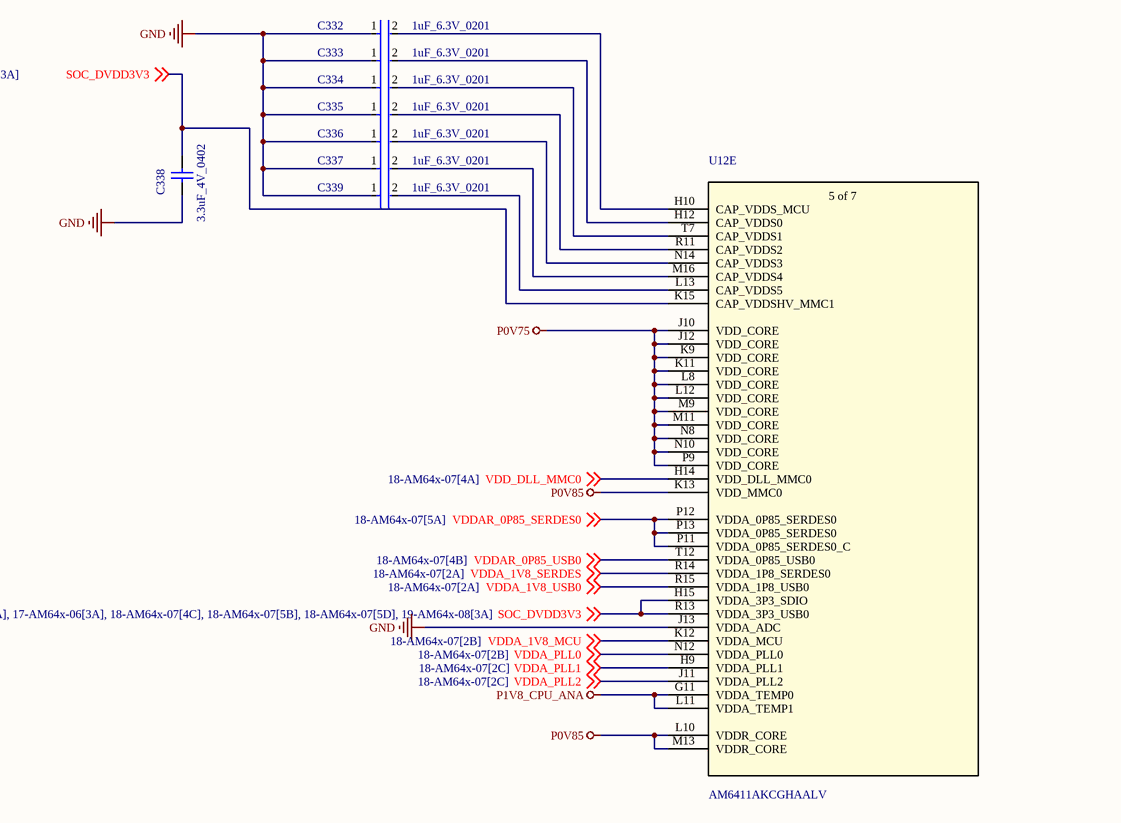
[diagram p15: 16-AM64x-05.SchDoc]

### Parts
C332  1uF_6.3V_0201  [FP-CL03-IPC_B]
C333  1uF_6.3V_0201  [FP-CL03-IPC_B]
C334  1uF_6.3V_0201  [FP-CL03-IPC_B]
C335  1uF_6.3V_0201  [FP-CL03-IPC_B]
C336  1uF_6.3V_0201  [FP-CL03-IPC_B]
C337  1uF_6.3V_0201  [FP-CL03-IPC_B]
C338  3.3uF_4V_0402  [CAPC1005X60X30LL05T10]
C339  1uF_6.3V_0201  [FP-CL03-IPC_B]
U12  AM6411AKCGHAALV  [FCBGA441_ALV_TEX]  (part E of 7)

### Nets
GND: C332.1 C333.1 C334.1 C335.1 C336.1 C337.1 C338.1 C339.1 U12.J13(VDDA_ADC)
P0V75: U12.J10(VDD_CORE) U12.J12(VDD_CORE) U12.K9(VDD_CORE) U12.K11(VDD_CORE) U12.L8(VDD_CORE) U12.L12(VDD_CORE) U12.M9(VDD_CORE) U12.M11(VDD_CORE) U12.N8(VDD_CORE) U12.N10(VDD_CORE) U12.P9(VDD_CORE)
P0V85: U12.K13(VDD_MMC0) U12.L10(VDDR_CORE) U12.M13(VDDR_CORE)
P1V8_CPU_ANA: U12.G11(VDDA_TEMP0) U12.L11(VDDA_TEMP1)
SOC_DVDD3V3: C338.2 U12.H15(VDDA_3P3_SDIO) U12.K15(CAP_VDDSHV_MMC1) U12.R13(VDDA_3P3_USB0) ; off-sheet SOC_DVDD3V3
VDD_DLL_MMC0: U12.H14(VDD_DLL_MMC0) ; off-sheet VDD_DLL_MMC0
VDDA_1V8_MCU: U12.K12(VDDA_MCU) ; off-sheet VDDA_1V8_MCU
VDDA_1V8_SERDES: U12.R14(VDDA_1P8_SERDES0) ; off-sheet VDDA_1V8_SERDES
VDDA_1V8_USB0: U12.R15(VDDA_1P8_USB0) ; off-sheet VDDA_1V8_USB0
VDDA_PLL0: U12.N12(VDDA_PLL0) ; off-sheet VDDA_PLL0
VDDA_PLL1: U12.H9(VDDA_PLL1) ; off-sheet VDDA_PLL1
VDDA_PLL2: U12.J11(VDDA_PLL2) ; off-sheet VDDA_PLL2
VDDAR_0P85_SERDES0: U12.P11(VDDA_0P85_SERDES0_C) U12.P12(VDDA_0P85_SERDES0) U12.P13(VDDA_0P85_SERDES0) ; off-sheet VDDAR_0P85_SERDES0
VDDAR_0P85_USB0: U12.T12(VDDA_0P85_USB0) ; off-sheet VDDAR_0P85_USB0
NetC332_2: C332.2 U12.H10(CAP_VDDS_MCU)
NetC333_2: C333.2 U12.H12(CAP_VDDS0)
NetC334_2: C334.2 U12.T7(CAP_VDDS1)
NetC335_2: C335.2 U12.R11(CAP_VDDS2)
NetC336_2: C336.2 U12.N14(CAP_VDDS3)
NetC337_2: C337.2 U12.M16(CAP_VDDS4)
NetC339_2: C339.2 U12.L13(CAP_VDDS5)

### Notes on the sheet
- (in symbol AM6411AKCGHAALV, part E) 5 of 7

### Library data of the parts
C332-C337 C339 = CMP-13271-002789-1: Cap Ceramic 1uF 6.3V X5R ±20% Pad SMD 0201 +85°C T/R; Tolerance: 20%; Voltage Rating: 6.3V; Mount: Surface Mount; Min Operating Temperature: -55°C; Package Quantity: 15000; Max Operating Temperature: 85°C; Height: 0.3mm; Packaging: Tape and Reel; Thickness: 0.013inch; Dielectric: X5R; Case/Package: 0201; Case Code (Imperial): 0201; Radiation Hardening: No; Case Code (Metric): 0603; Capacitance: 1uF; Width: 0.012inch; Depth: 0.3mm; Length: 0.6mm
C338 = CMP-1034-02130-2: Part Number: C0402C335M7PACTU; Manufacturer: Kemet
U12 = AM6411AKCGHAALV: as U12 on sheet 12-AM64x-01; RefDes: RefDes; Type: Type

## Sheet 17-AM64x-06.SchDoc
size B; SheetNumber: 17; SheetTotal: 25
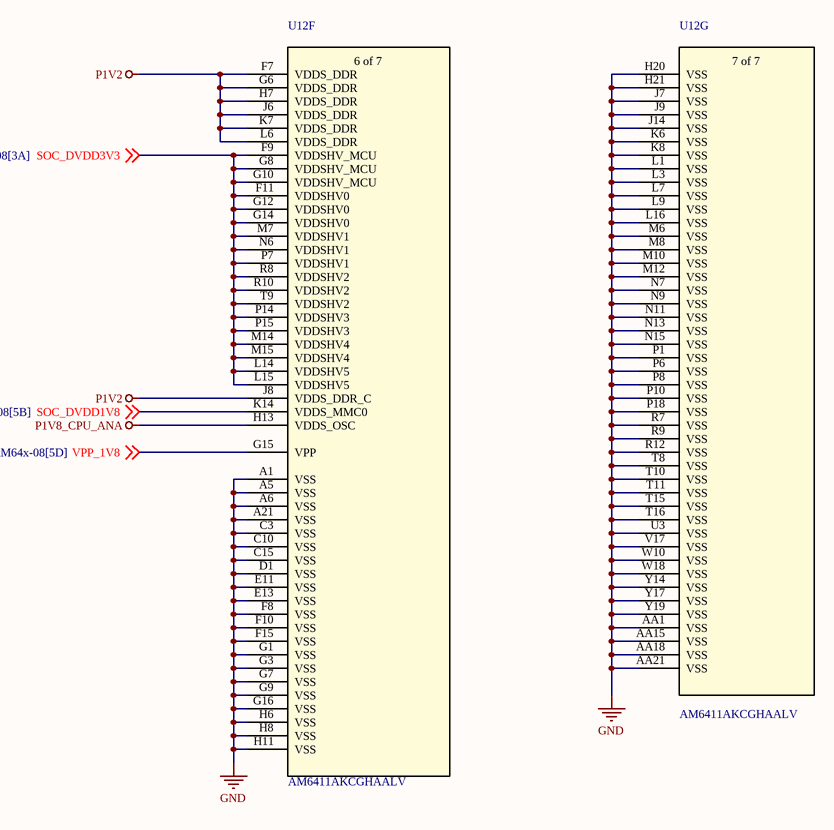
[diagram p16: 17-AM64x-06.SchDoc]

### Parts
U12  AM6411AKCGHAALV  [FCBGA441_ALV_TEX]  (parts F,G of 7)

### Nets
GND: U12.A1(VSS) U12.A5(VSS) U12.A6(VSS) U12.A21(VSS) U12.AA1(VSS) U12.AA15(VSS) U12.AA18(VSS) U12.AA21(VSS) U12.C3(VSS) U12.C10(VSS) U12.C15(VSS) U12.D1(VSS) U12.E11(VSS) U12.E13(VSS) U12.F8(VSS) U12.F10(VSS) U12.F15(VSS) U12.G1(VSS) U12.G3(VSS) U12.G7(VSS) U12.G9(VSS) U12.G16(VSS) U12.H6(VSS) U12.H8(VSS) U12.H11(VSS) U12.H20(VSS) U12.H21(VSS) U12.J7(VSS) U12.J9(VSS) U12.J14(VSS) U12.K6(VSS) U12.K8(VSS) U12.L1(VSS) U12.L3(VSS) U12.L7(VSS) U12.L9(VSS) U12.L16(VSS) U12.M6(VSS) U12.M8(VSS) U12.M10(VSS) U12.M12(VSS) U12.N7(VSS) U12.N9(VSS) U12.N11(VSS) U12.N13(VSS) U12.N15(VSS) U12.P1(VSS) U12.P6(VSS) U12.P8(VSS) U12.P10(VSS) U12.P18(VSS) U12.R7(VSS) U12.R9(VSS) U12.R12(VSS) U12.T8(VSS) U12.T10(VSS) U12.T11(VSS) U12.T15(VSS) U12.T16(VSS) U12.U3(VSS) U12.V17(VSS) U12.W10(VSS) U12.W18(VSS) U12.Y14(VSS) U12.Y17(VSS) U12.Y19(VSS)
P1V2: U12.F7(VDDS_DDR) U12.G6(VDDS_DDR) U12.H7(VDDS_DDR) U12.J6(VDDS_DDR) U12.J8(VDDS_DDR_C) U12.K7(VDDS_DDR) U12.L6(VDDS_DDR)
P1V8_CPU_ANA: U12.H13(VDDS_OSC)
SOC_DVDD1V8: U12.K14(VDDS_MMC0) ; off-sheet SOC_DVDD1V8
SOC_DVDD3V3: U12.F9(VDDSHV_MCU) U12.F11(VDDSHV0) U12.G8(VDDSHV_MCU) U12.G10(VDDSHV_MCU) U12.G12(VDDSHV0) U12.G14(VDDSHV0) U12.L14(VDDSHV5) U12.L15(VDDSHV5) U12.M7(VDDSHV1) U12.M14(VDDSHV4) U12.M15(VDDSHV4) U12.N6(VDDSHV1) U12.P7(VDDSHV1) U12.P14(VDDSHV3) U12.P15(VDDSHV3) U12.R8(VDDSHV2) U12.R10(VDDSHV2) U12.T9(VDDSHV2) ; off-sheet SOC_DVDD3V3
VPP_1V8: U12.G15(VPP) ; off-sheet VPP_1V8

### Notes on the sheet
- (in symbol AM6411AKCGHAALV, part F) 6 of 7
- (in symbol AM6411AKCGHAALV, part G) 7 of 7

### Library data of the parts
U12 = AM6411AKCGHAALV: as U12 on sheet 12-AM64x-01; RefDes: RefDes; Type: Type